# Altium schematic sheet Sheet1.SchDoc
size 1249 x 800 mm; SheetNumber: 1; SheetTotal: 1
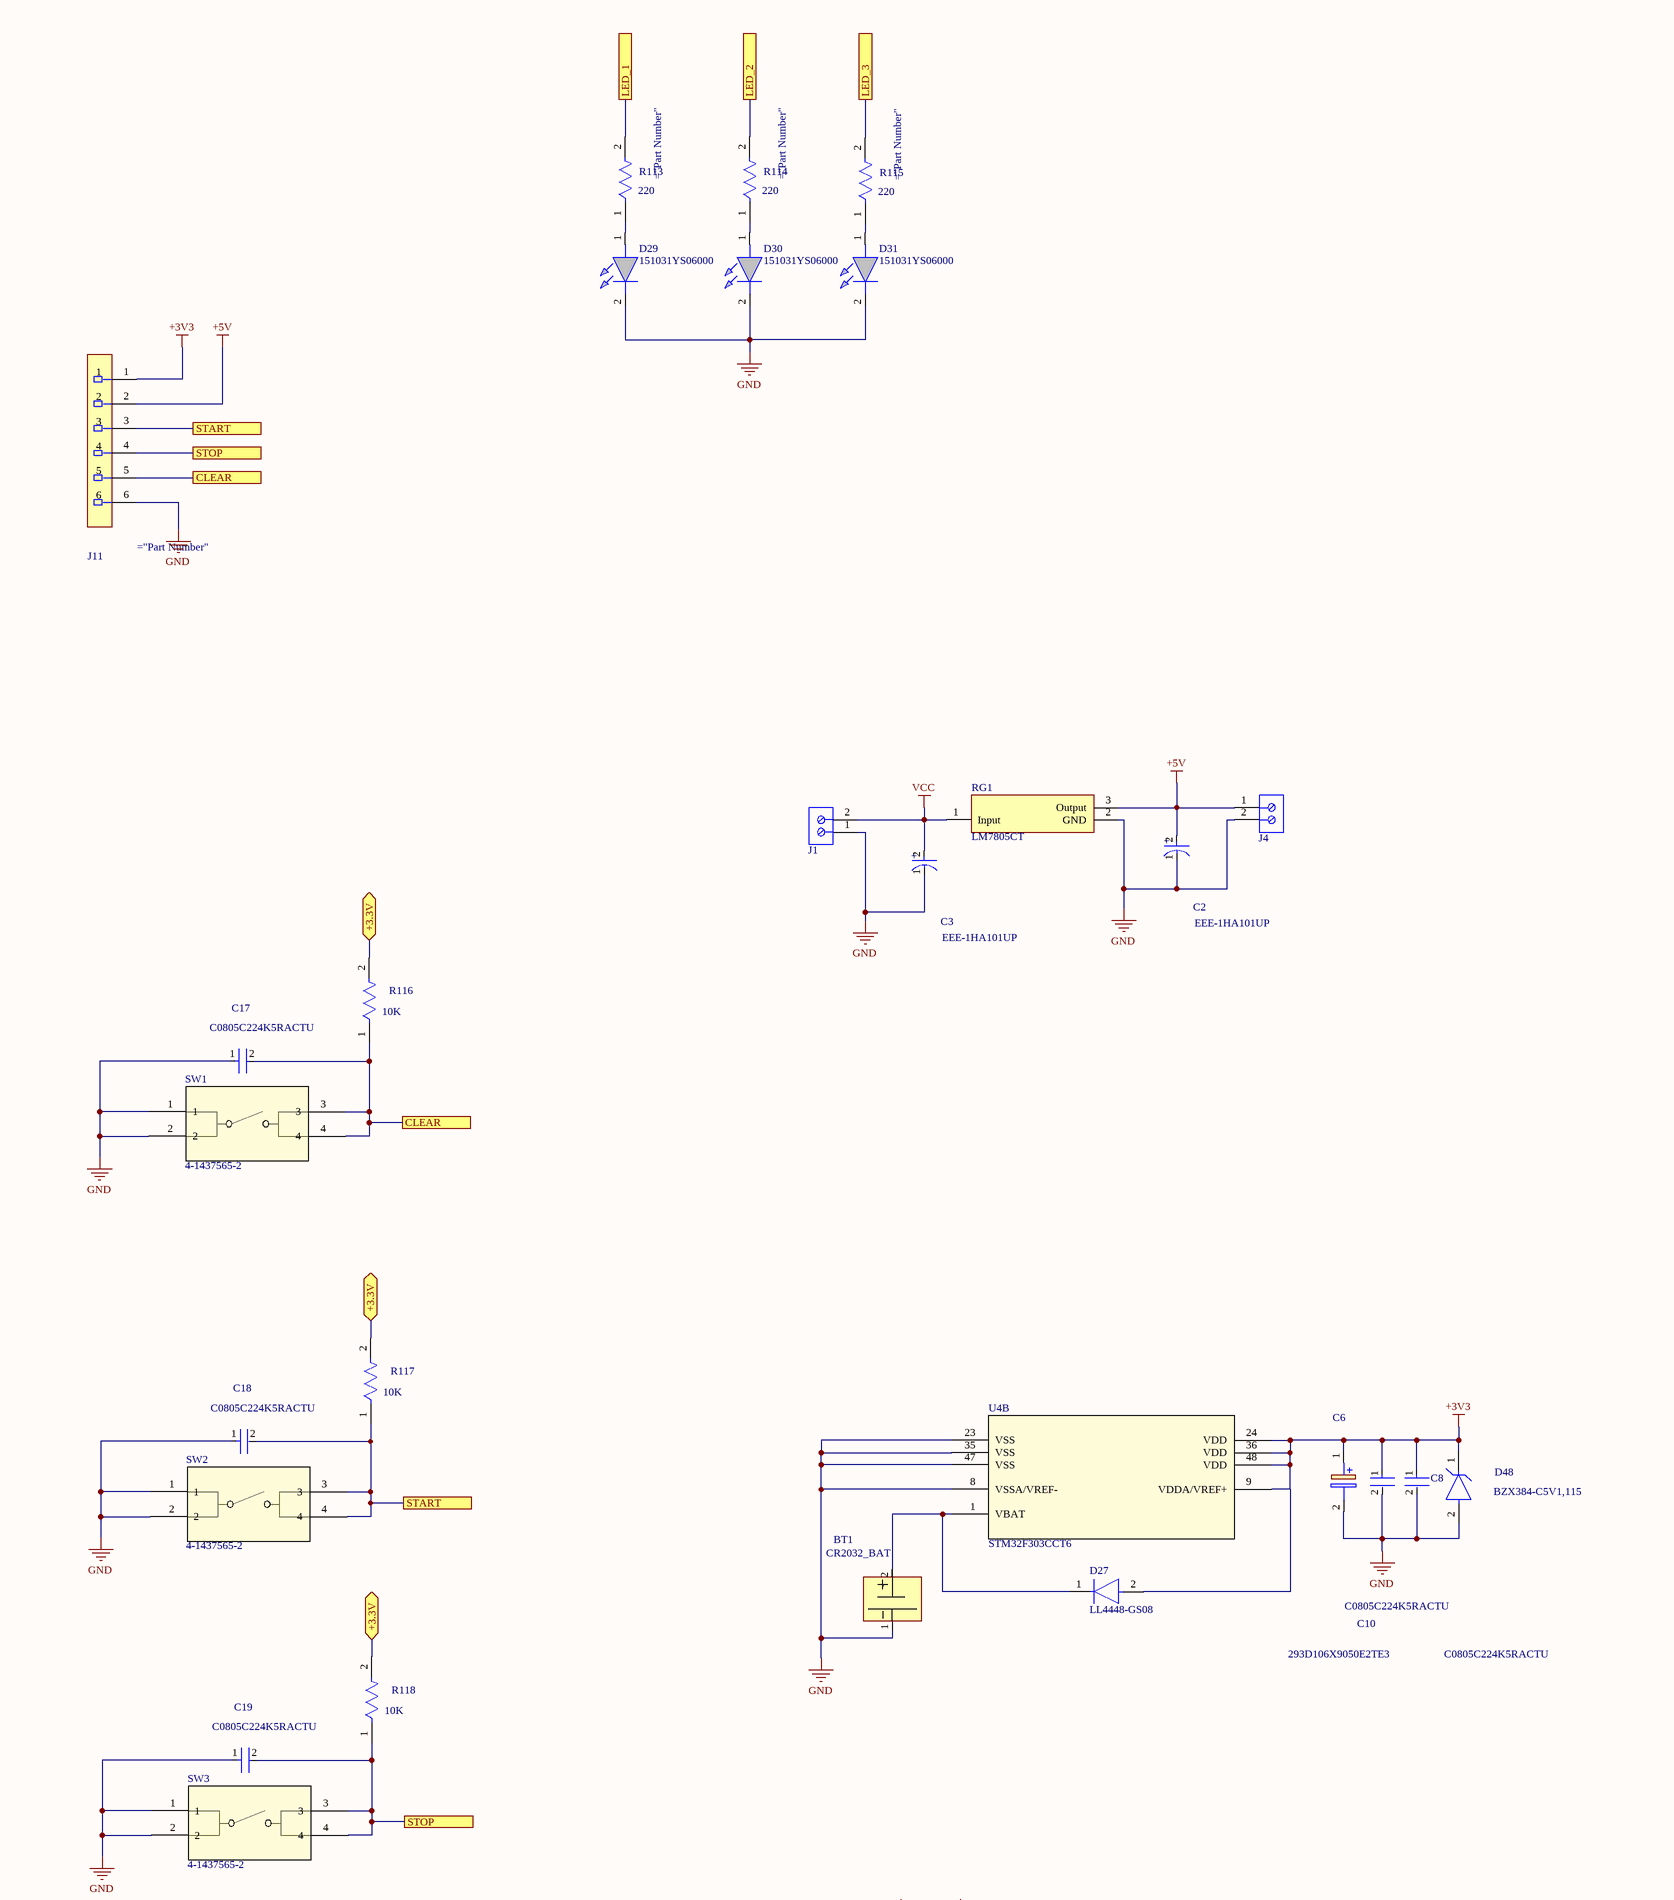
[diagram p0: Sheet1.SchDoc, top left]
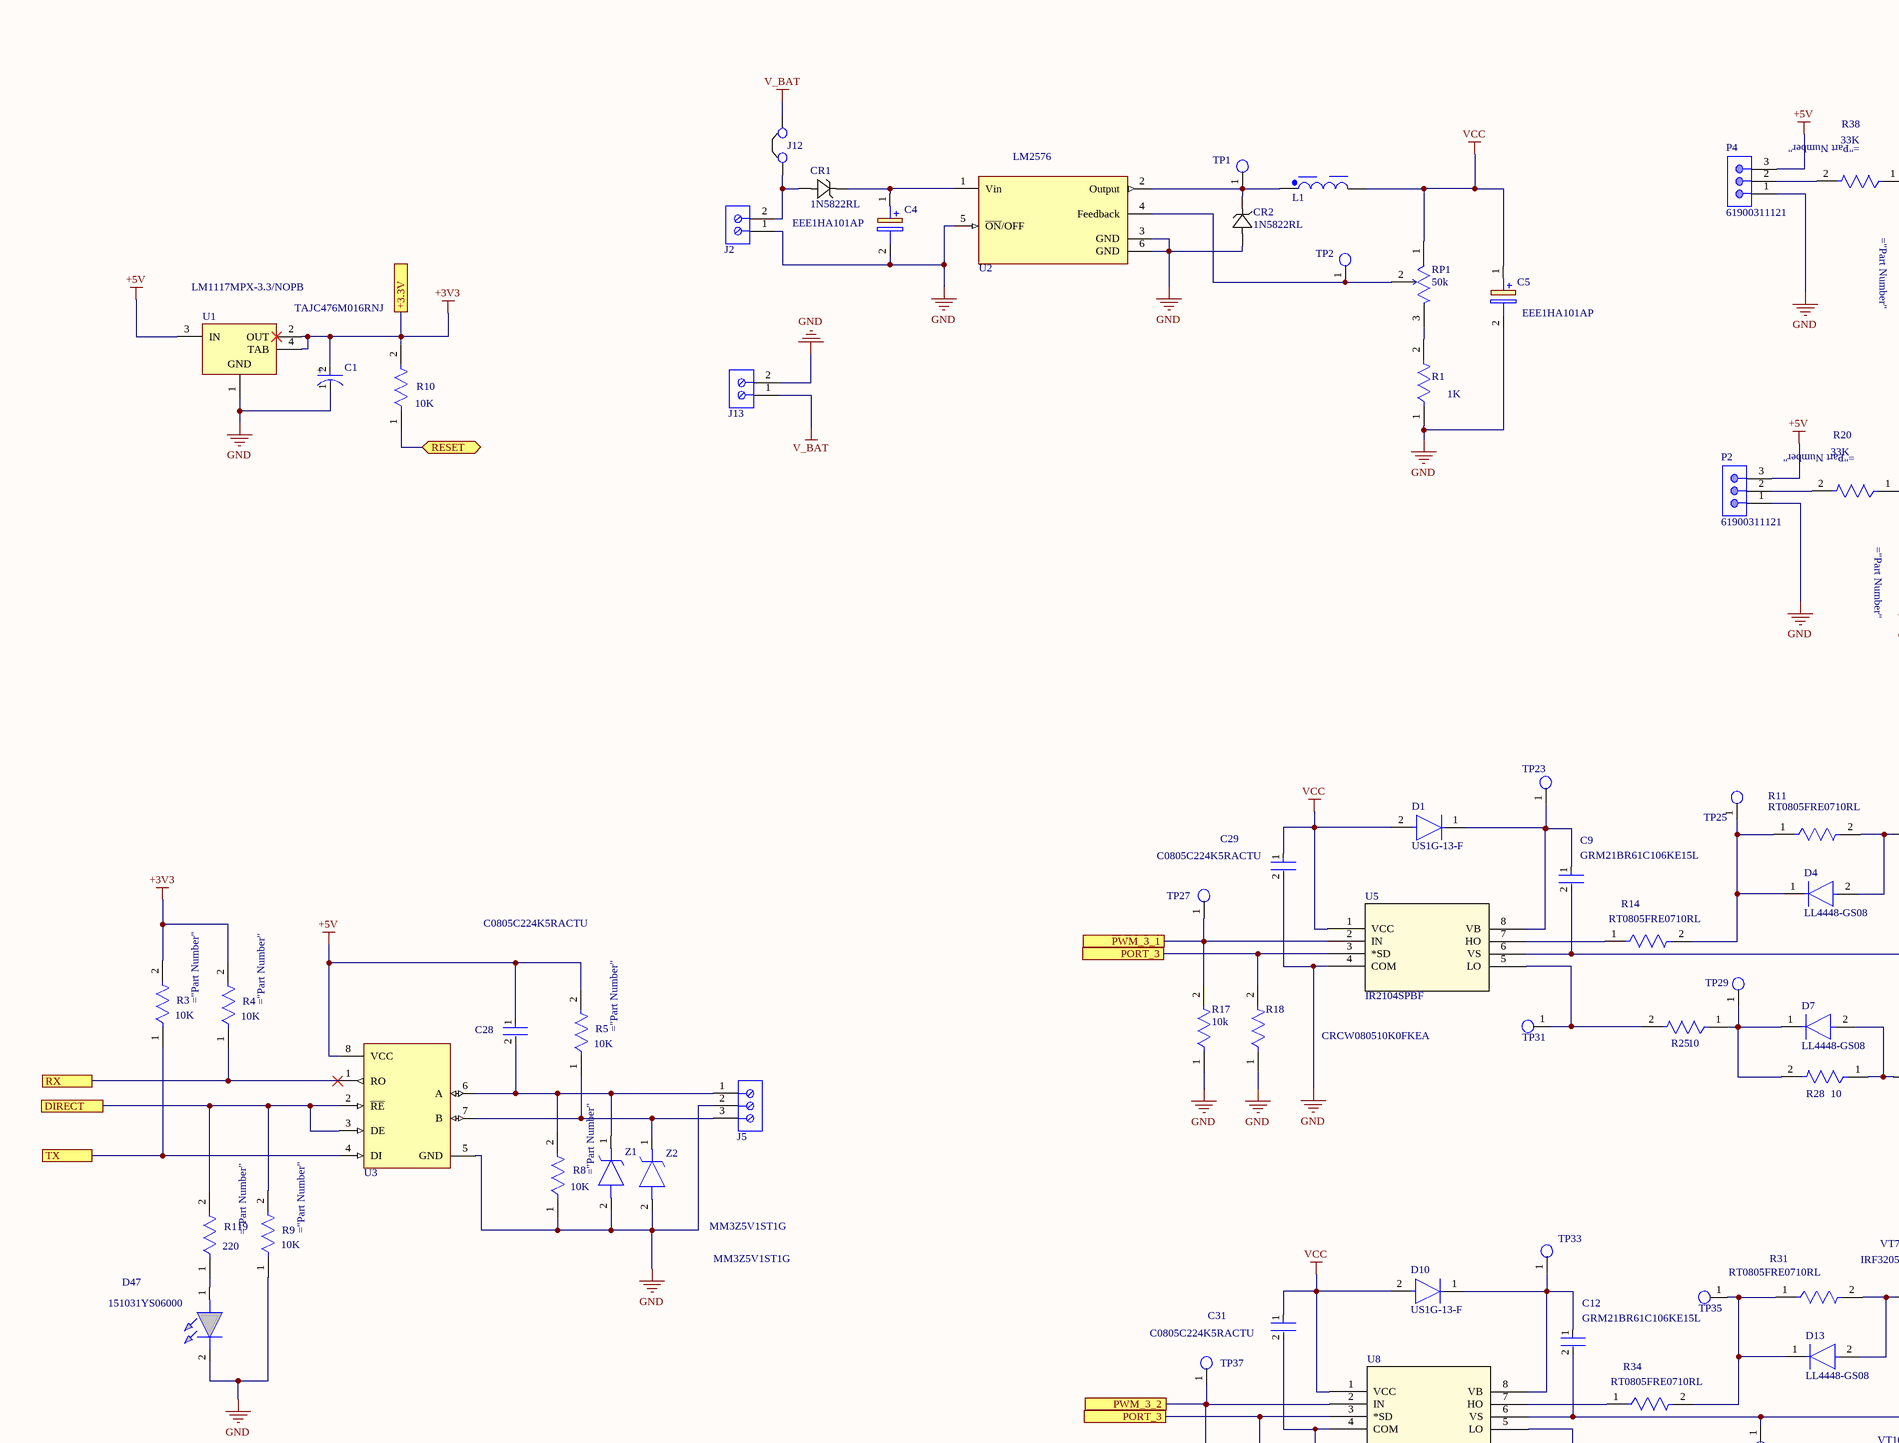
[diagram p1: Sheet1.SchDoc, top middle]
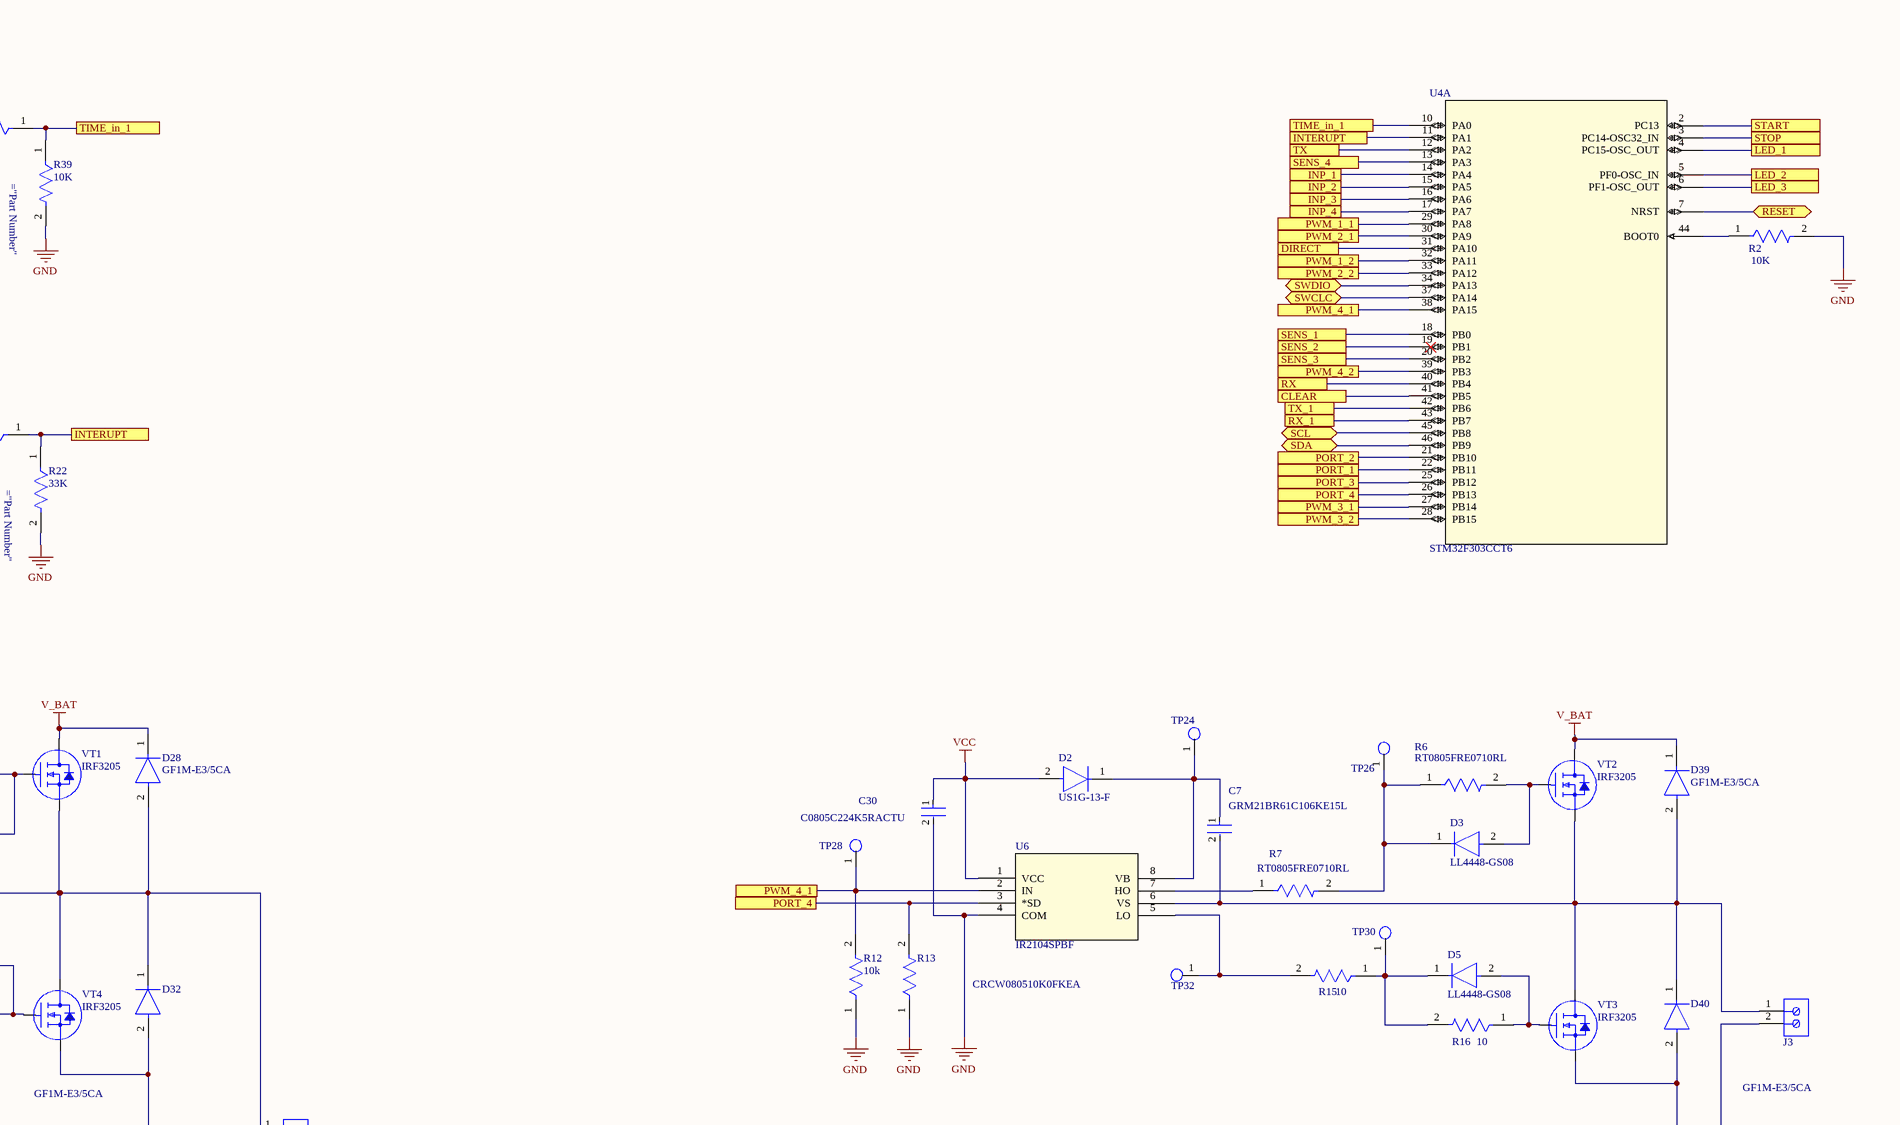
[diagram p2: Sheet1.SchDoc, top right]
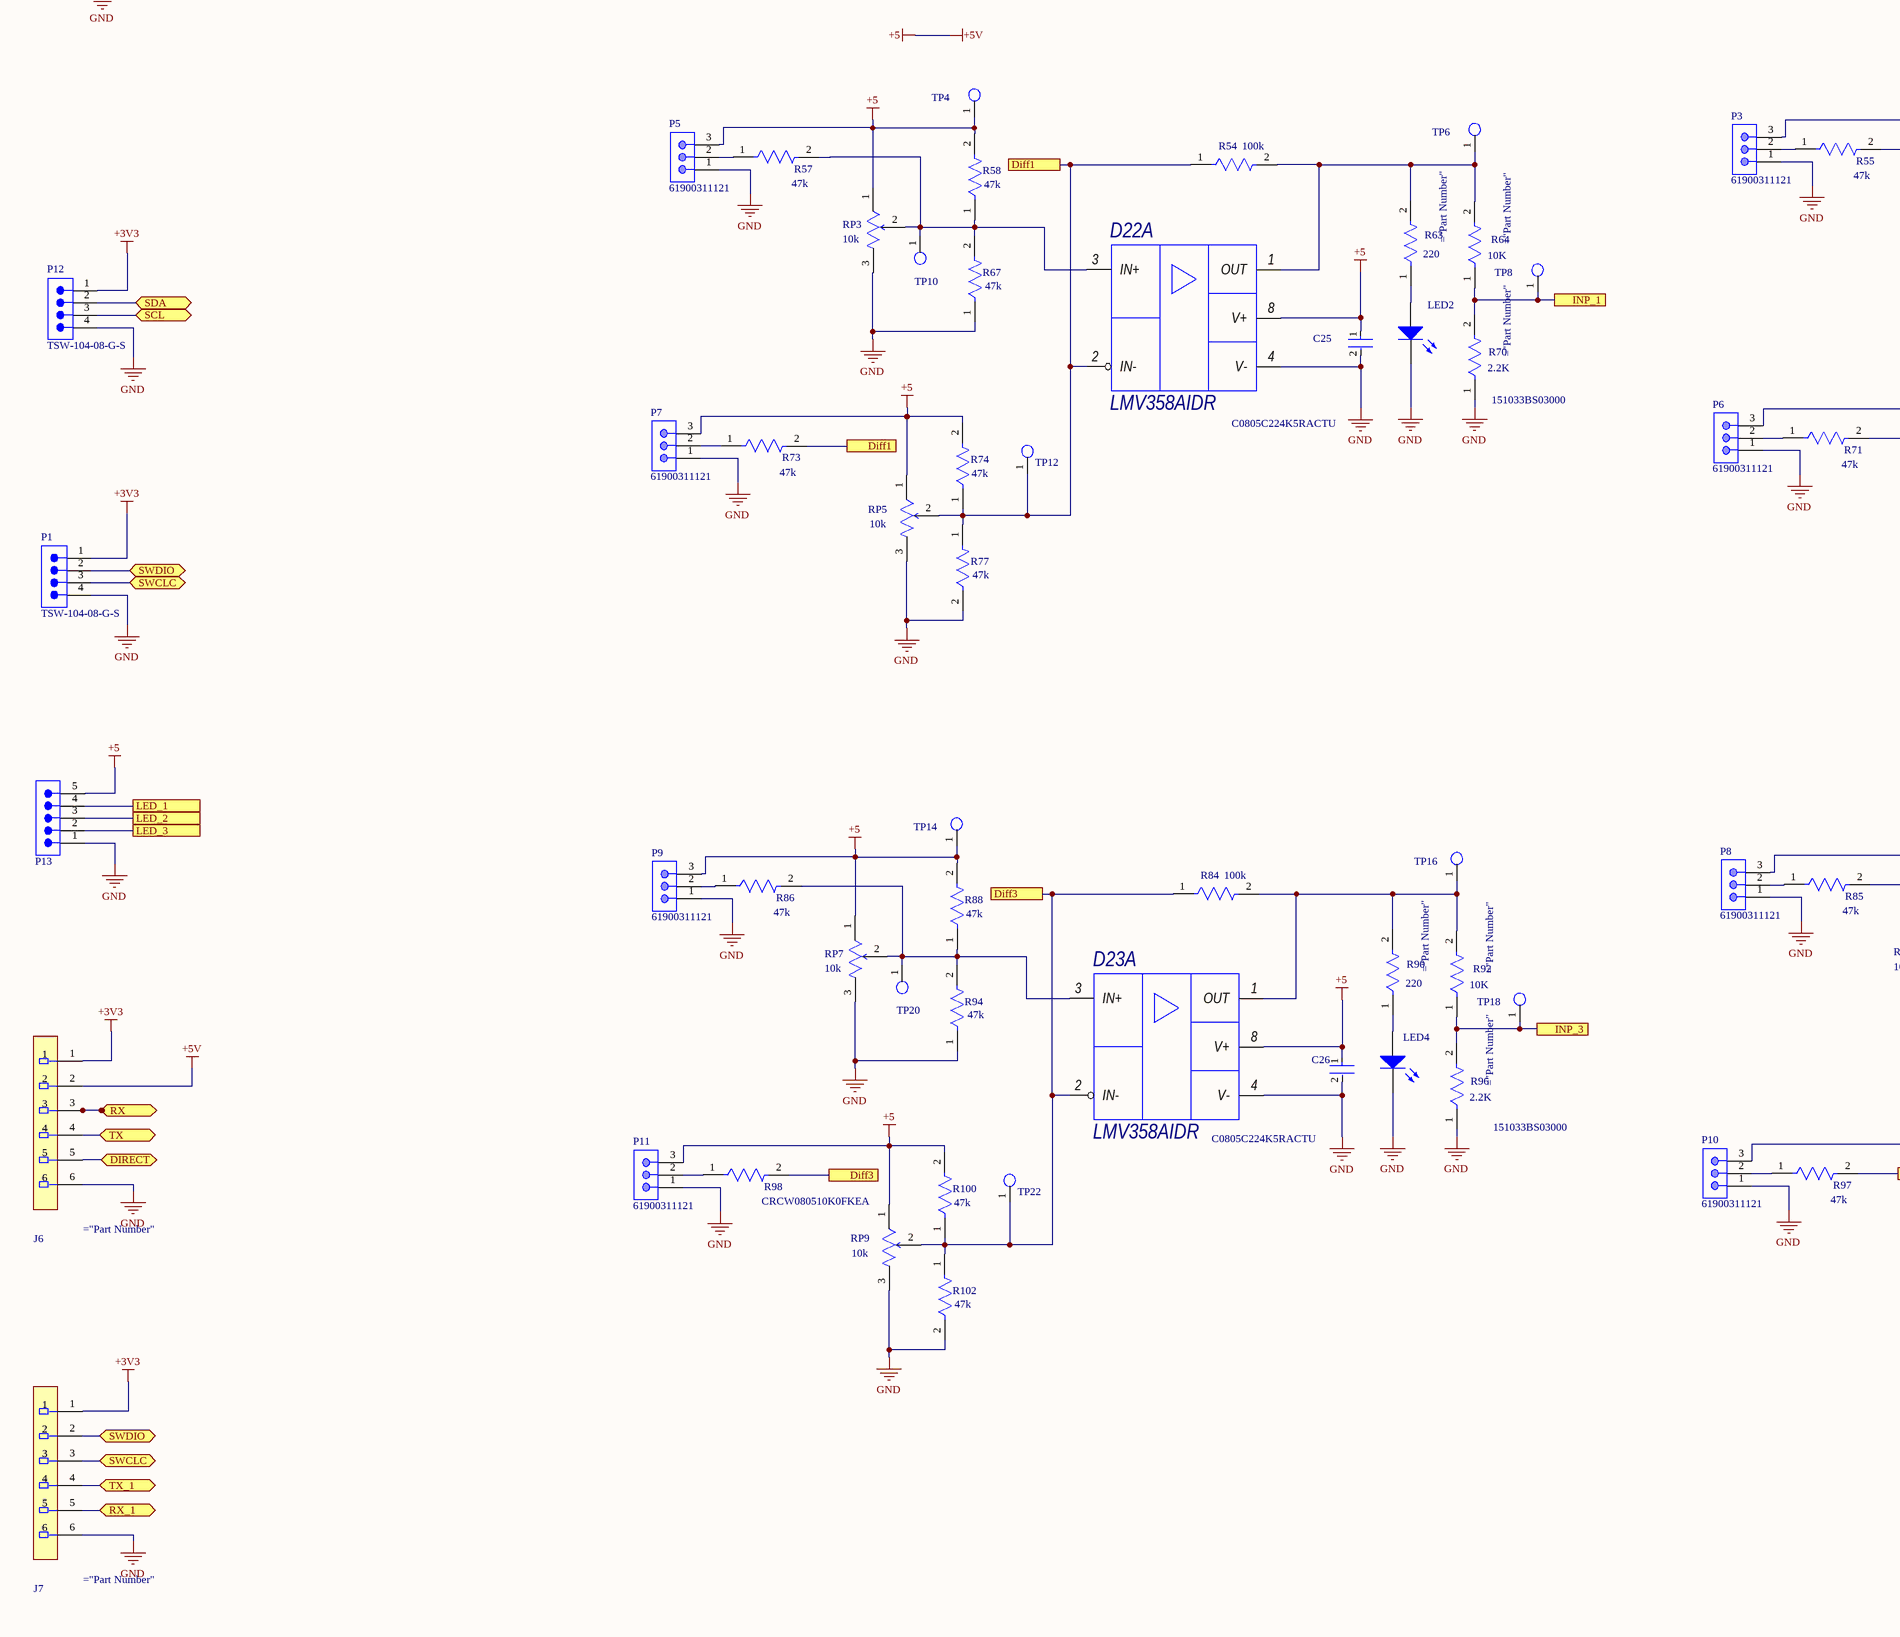
[diagram p3: Sheet1.SchDoc, bottom left]
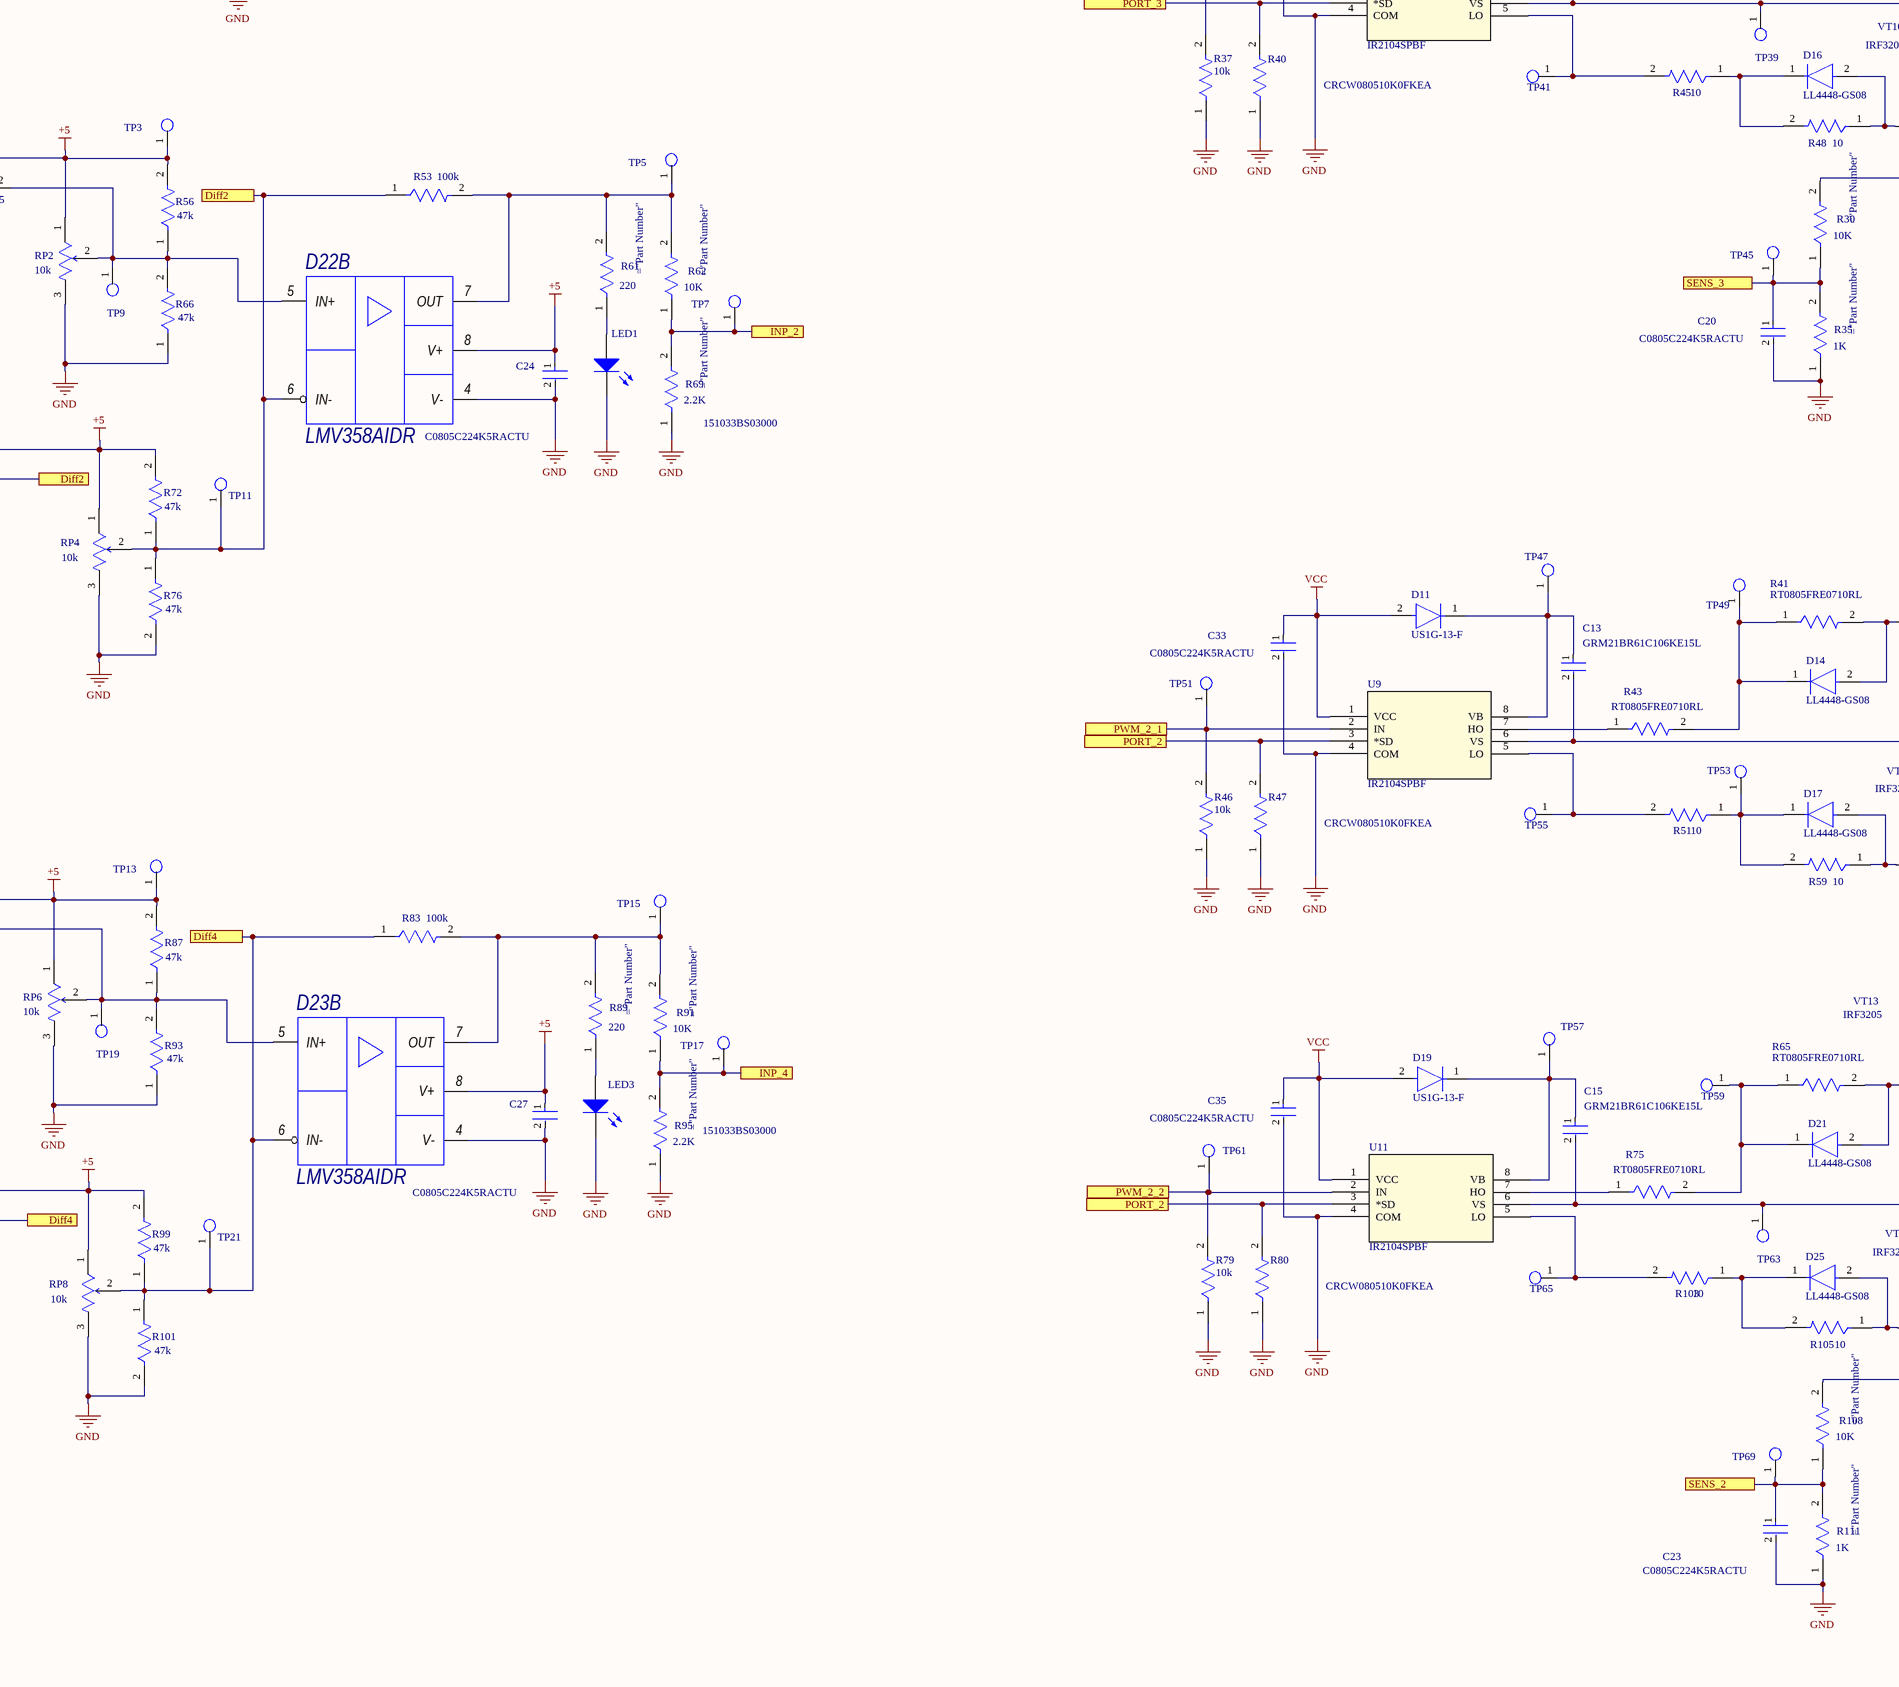
[diagram p4: Sheet1.SchDoc, bottom middle]
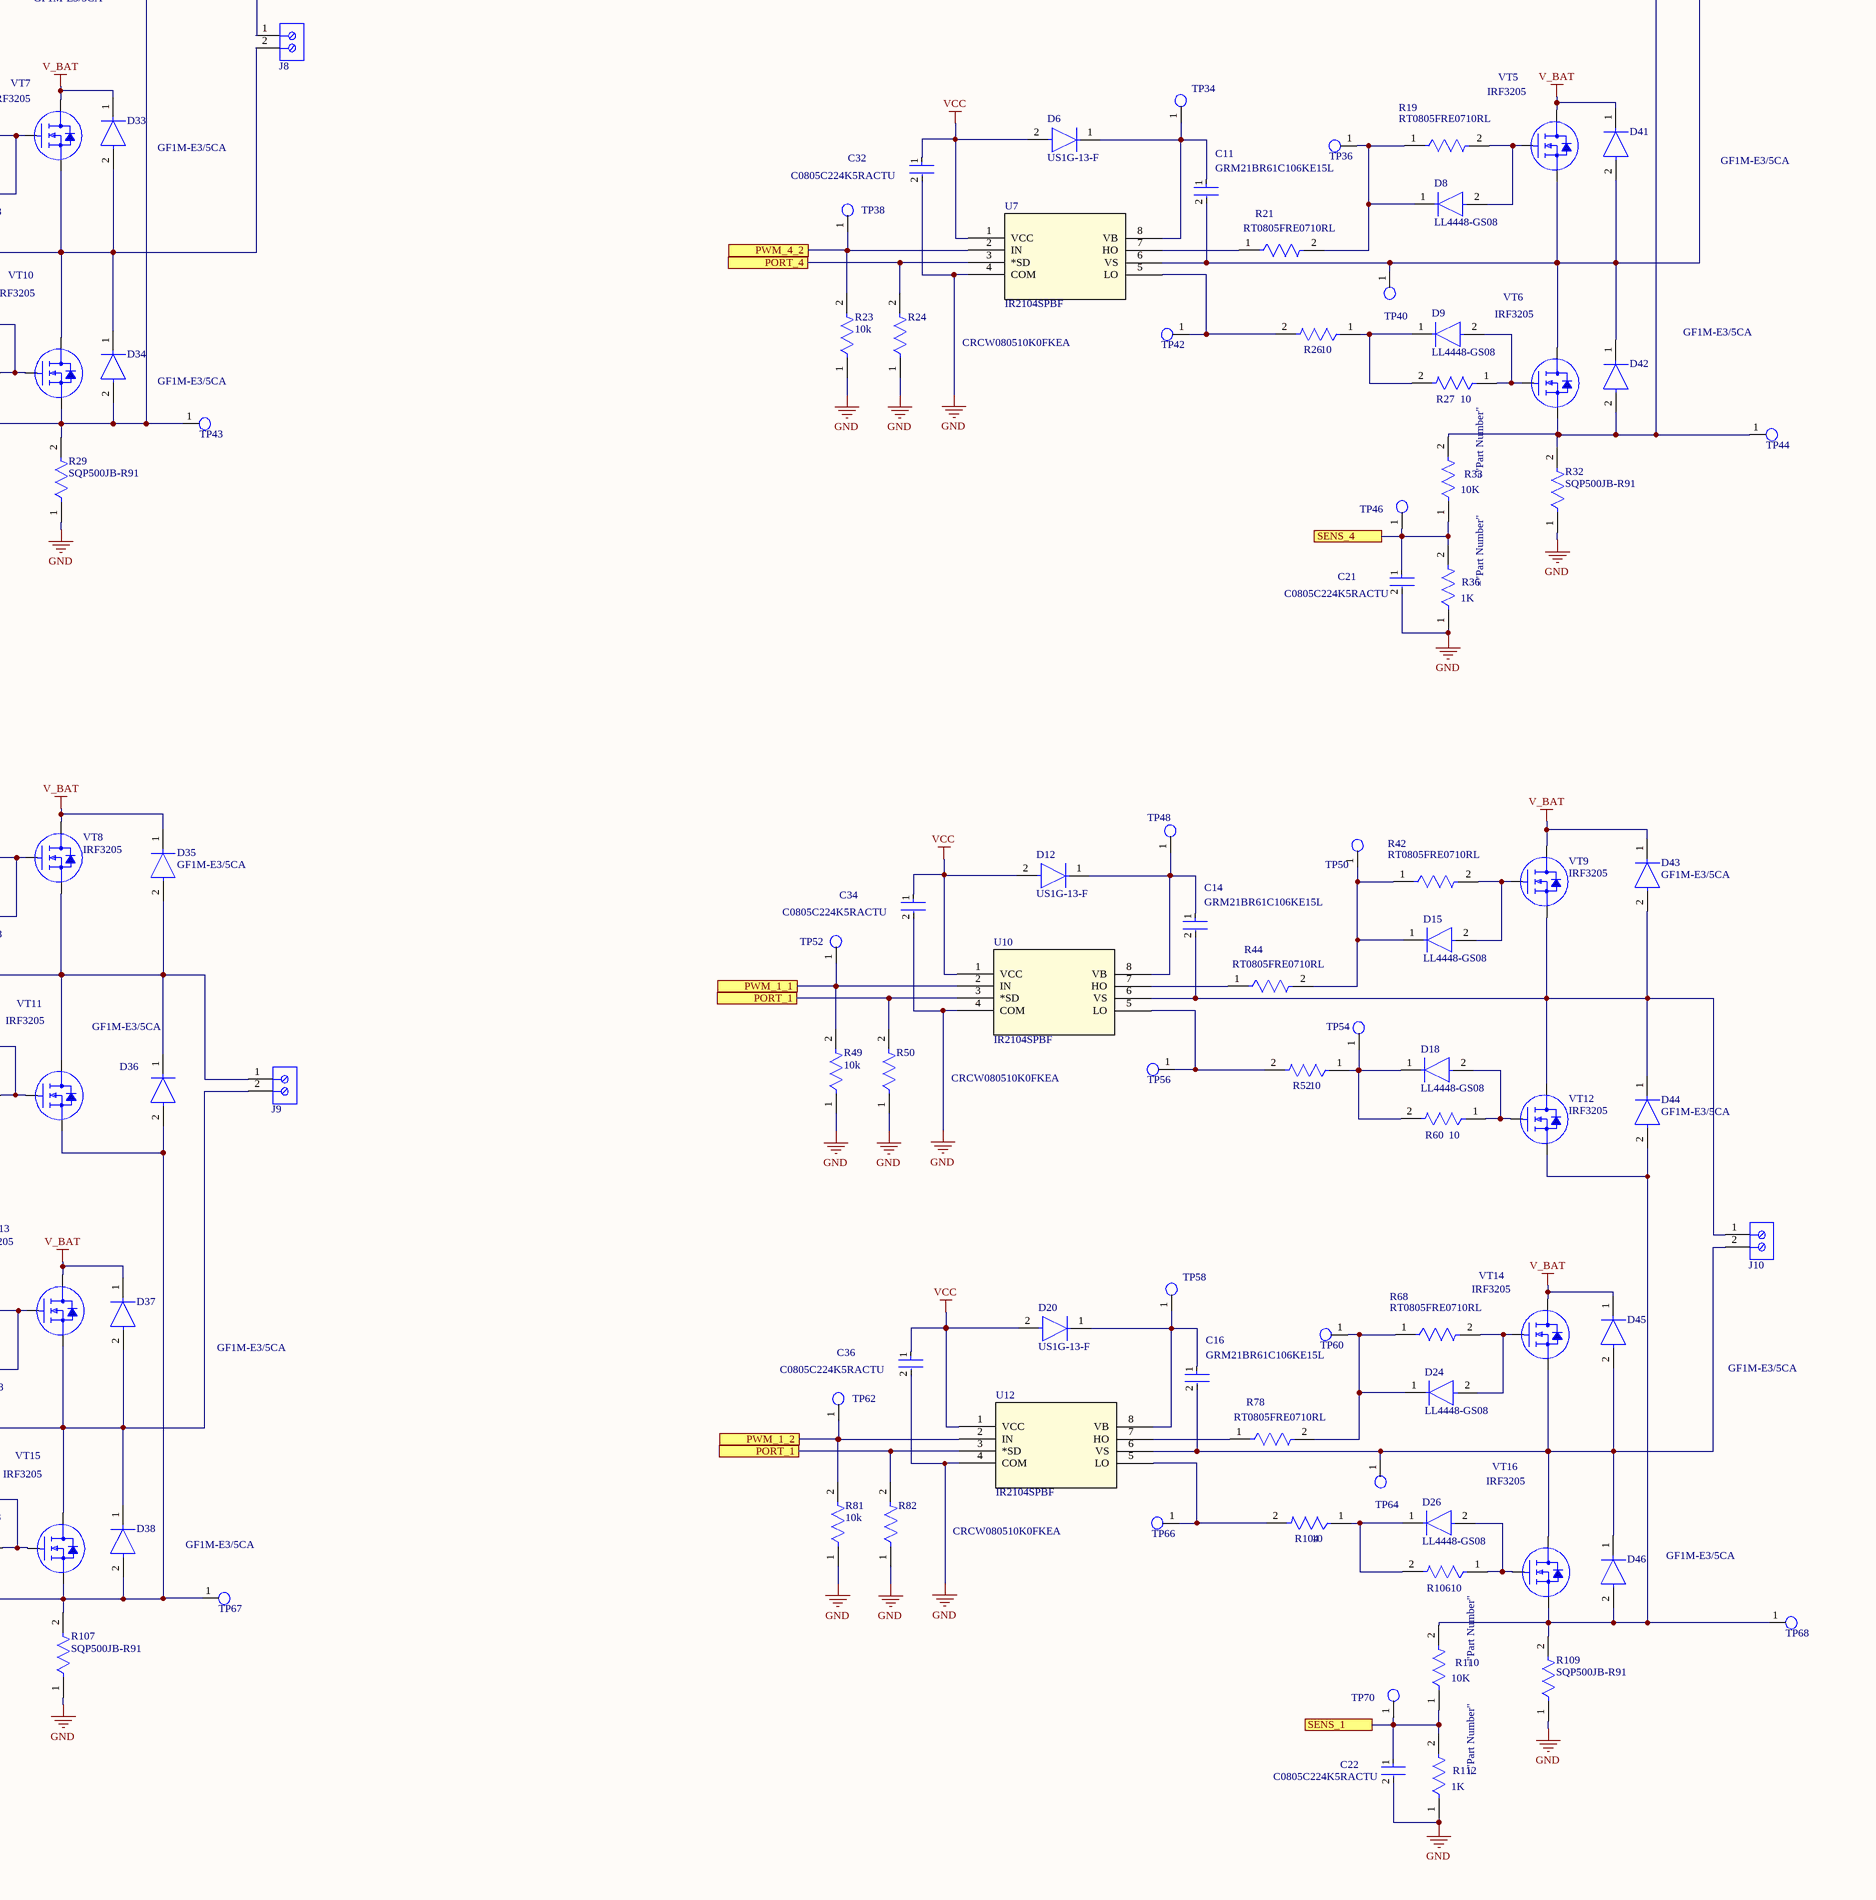
[diagram p5: Sheet1.SchDoc, bottom right]

## Parts
BT1  CR2032_BAT  [CR2032_BAT]
C1  TAJC476M016RNJ  [FP-TAJC-MFG]
C2  EEE-1HA101UP  [FP-SF-MFG]
C3  EEE-1HA101UP  [FP-SF-MFG]
C4  EEE1HA101AP  [EEEFK1V331P]
C5  EEE1HA101AP  [EEEFK1V331P]
C6  293D106X9050E2TE3  [CAPPM7343X430N]
C7  GRM21BR61C106KE15L  [FP-GRM21B-0_1-IPC_C]
C8  C0805C224K5RACTU  [FP-C0805C-DN-MFG]
C9  GRM21BR61C106KE15L  [FP-GRM21B-0_1-IPC_C]
C10  C0805C224K5RACTU  [FP-C0805C-DN-MFG]
C11  GRM21BR61C106KE15L  [FP-GRM21B-0_1-IPC_C]
C12  GRM21BR61C106KE15L  [FP-GRM21B-0_1-IPC_C]
C13  GRM21BR61C106KE15L  [FP-GRM21B-0_1-IPC_C]
C14  GRM21BR61C106KE15L  [FP-GRM21B-0_1-IPC_C]
C15  GRM21BR61C106KE15L  [FP-GRM21B-0_1-IPC_C]
C16  GRM21BR61C106KE15L  [FP-GRM21B-0_1-IPC_C]
C17  C0805C224K5RACTU  [FP-C0805C-DN-IPC_A]
C18  C0805C224K5RACTU  [FP-C0805C-DN-IPC_A]
C19  C0805C224K5RACTU  [FP-C0805C-DN-IPC_A]
C20  C0805C224K5RACTU  [FP-C0805C-DN-MFG]
C21  C0805C224K5RACTU  [FP-C0805C-DN-MFG]
C22  C0805C224K5RACTU  [FP-C0805C-DN-MFG]
C23  C0805C224K5RACTU  [FP-C0805C-DN-MFG]
C24  C0805C224K5RACTU  [FP-C0805C-DN-MFG]
C25  C0805C224K5RACTU  [FP-C0805C-DN-MFG]
C26  C0805C224K5RACTU  [FP-C0805C-DN-MFG]
C27  C0805C224K5RACTU  [FP-C0805C-DN-MFG]
C28  C0805C224K5RACTU  [FP-C0805C-DN-MFG]
C29  C0805C224K5RACTU  [FP-C0805C-DN-MFG]
C30  C0805C224K5RACTU  [FP-C0805C-DN-MFG]
C31  C0805C224K5RACTU  [FP-C0805C-DN-MFG]
C32  C0805C224K5RACTU  [FP-C0805C-DN-MFG]
C33  C0805C224K5RACTU  [FP-C0805C-DN-MFG]
C34  C0805C224K5RACTU  [FP-C0805C-DN-MFG]
C35  C0805C224K5RACTU  [FP-C0805C-DN-MFG]
C36  C0805C224K5RACTU  [FP-C0805C-DN-MFG]
CR1  1N5822RL  [DO-201AD_STM]
CR2  1N5822RL  [DO-201AD_STM]
D1  US1G-13-F  [FP-SMA-MFG]
D2  US1G-13-F  [FP-SMA-MFG]
D3  LL4448-GS08  [FP-6_560-5005_01-4-MFG]
D4  LL4448-GS08  [FP-6_560-5005_01-4-MFG]
D5  LL4448-GS08  [FP-6_560-5005_01-4-MFG]
D6  US1G-13-F  [FP-SMA-MFG]
D7  LL4448-GS08  [FP-6_560-5005_01-4-MFG]
D8  LL4448-GS08  [FP-6_560-5005_01-4-MFG]
D9  LL4448-GS08  [FP-6_560-5005_01-4-MFG]
D10  US1G-13-F  [FP-SMA-MFG]
D11  US1G-13-F  [FP-SMA-MFG]
D12  US1G-13-F  [FP-SMA-MFG]
D13  LL4448-GS08  [FP-6_560-5005_01-4-MFG]
D14  LL4448-GS08  [FP-6_560-5005_01-4-MFG]
D15  LL4448-GS08  [FP-6_560-5005_01-4-MFG]
D16  LL4448-GS08  [FP-6_560-5005_01-4-MFG]
D17  LL4448-GS08  [FP-6_560-5005_01-4-MFG]
D18  LL4448-GS08  [FP-6_560-5005_01-4-MFG]
D19  US1G-13-F  [FP-SMA-MFG]
D20  US1G-13-F  [FP-SMA-MFG]
D21  LL4448-GS08  [FP-6_560-5005_01-4-MFG]
D22  LMV358AIDR  [8-SOIC]  (parts A,B of 2)
D23  LMV358AIDR  [8-SOIC]  (parts A,B of 2)
D24  LL4448-GS08  [FP-6_560-5005_01-4-MFG]
D25  LL4448-GS08  [FP-6_560-5005_01-4-MFG]
D26  LL4448-GS08  [FP-6_560-5005_01-4-MFG]
D27  LL4448-GS08  [FP-6_560-5005_01-4-MFG]
D28  GF1M-E3/5CA  [FP-GF1M-E3-5CA-MFG]
D29  151031YS06000  [Wurth_Electronics_0_MFG]
D30  151031YS06000  [LED_GREEN]
D31  151031YS06000  [LED_BLUE]
D32  GF1M-E3/5CA  [FP-GF1M-E3-5CA-MFG]
D33  GF1M-E3/5CA  [FP-GF1M-E3-5CA-MFG]
D34  GF1M-E3/5CA  [FP-GF1M-E3-5CA-MFG]
D35  GF1M-E3/5CA  [FP-GF1M-E3-5CA-MFG]
D36  GF1M-E3/5CA  [FP-GF1M-E3-5CA-MFG]
D37  GF1M-E3/5CA  [FP-GF1M-E3-5CA-MFG]
D38  GF1M-E3/5CA  [FP-GF1M-E3-5CA-MFG]
D39  GF1M-E3/5CA  [FP-GF1M-E3-5CA-MFG]
D40  GF1M-E3/5CA  [FP-GF1M-E3-5CA-MFG]
D41  GF1M-E3/5CA  [FP-GF1M-E3-5CA-MFG]
D42  GF1M-E3/5CA  [FP-GF1M-E3-5CA-MFG]
D43  GF1M-E3/5CA  [FP-GF1M-E3-5CA-MFG]
D44  GF1M-E3/5CA  [FP-GF1M-E3-5CA-MFG]
D45  GF1M-E3/5CA  [FP-GF1M-E3-5CA-MFG]
D46  GF1M-E3/5CA  [FP-GF1M-E3-5CA-MFG]
D47  151031YS06000  [LED_BLUE]
D48  BZX384-C5V1,115  [FP-SOD323-MFG]
J1  691101710002  [691101710002]  (value not drawn)
J2  691101710002  [691101710002]  (value not drawn)
J3  691101710002  [691101710002]  (value not drawn)
J4  691101710002  [691101710002]  (value not drawn)
J5  691101710003  [691101710003]  (value not drawn)
J6  SWR25X-NRTC-S06-ST-BA  [Sullins_SWR25X-NRTC-S06-ST-BA_MFG]  (value not drawn)
J7  SWR25X-NRTC-S06-ST-BA  [Sullins_SWR25X-NRTC-S06-ST-BA_MFG]  (value not drawn)
J8  691101710002  [691101710002]  (value not drawn)
J9  691101710002  [691101710002]  (value not drawn)
J10  691101710002  [691101710002]  (value not drawn)
J11  SWR25X-NRTC-S06-ST-BA  [Sullins_SWR25X-NRTC-S06-ST-BA_MFG]  (value not drawn)
J12  Jumper 1x2.54  [Jumper_2.54]  (value not drawn)
J13  691101710002  [691101710002]  (value not drawn)
L1  22µH, 2.04A  [WE-PD2_1054]  (value not drawn)
LED1  151033BS03000  [Type 3mm]
LED2  151033BS03000  [Type 3mm]
LED3  151033BS03000  [Type 3mm]
LED4  151033BS03000  [Type 3mm]
P1  TSW-104-08-G-S  [SMTC-TSW-104-08-X-S]
P2  61900311121  [61900311121]
P3  61900311121  [61900311121]
P4  61900311121  [61900311121]
P5  61900311121  [61900311121]
P6  61900311121  [61900311121]
P7  61900311121  [61900311121]
P8  61900311121  [61900311121]
P9  61900311121  [61900311121]
P10  61900311121  [61900311121]
P11  61900311121  [61900311121]
P12  TSW-104-08-G-S  [SMTC-TSW-104-08-X-S]
P13  61300511121  [61300511121]  (value not drawn)
R1  1K  [Vishay_CRCW0805-e3_IPC_C]
R2  10K  [Vishay_CRCW0805-e3_IPC_A]
R3  10K  [Vishay_CRCW0805-e3_IPC_A]
R4  10K  [Vishay_CRCW0805-e3_IPC_A]
R5  10K  [Vishay_CRCW0805-e3_IPC_A]
R6  RT0805FRE0710RL  [FP-RT0805-IPC_C]
R7  RT0805FRE0710RL  [FP-RT0805-MFG]
R8  10K  [Vishay_CRCW0805-e3_IPC_A]
R9  10K  [Vishay_CRCW0805-e3_IPC_A]
R10  10K  [Vishay_CRCW0805-e3_IPC_A]
R11  RT0805FRE0710RL  [FP-RT0805-IPC_C]
R12  10k  [Vishay_CRCW0805-e3_IPC_A]
R13  CRCW080510K0FKEA  [FP-CRCW0805-e3-IPC_A]
R14  RT0805FRE0710RL  [FP-RT0805-MFG]
R15  10  [Vishay_CRCW0805-e3_IPC_A]
R16  10  [Vishay_CRCW0805-e3_IPC_A]
R17  10k  [Vishay_CRCW0805-e3_IPC_A]
R18  CRCW080510K0FKEA  [FP-CRCW0805-e3-IPC_A]
R19  RT0805FRE0710RL  [FP-RT0805-IPC_C]
R20  33K  [Vishay_CRCW0805-e3_IPC_A]
R21  RT0805FRE0710RL  [FP-RT0805-MFG]
R22  33K  [Vishay_CRCW0805-e3_IPC_A]
R23  10k  [Vishay_CRCW0805-e3_IPC_A]
R24  CRCW080510K0FKEA  [FP-CRCW0805-e3-IPC_A]
R25  10  [Vishay_CRCW0805-e3_IPC_A]
R26  10  [Vishay_CRCW0805-e3_IPC_A]
R27  10  [Vishay_CRCW0805-e3_IPC_A]
R28  10  [Vishay_CRCW0805-e3_IPC_A]
R29  SQP500JB-R91  [FP-SQP500-MFG]
R30  10K  [Yageo_RC0805_IPC_C]
R31  RT0805FRE0710RL  [FP-RT0805-IPC_C]
R32  SQP500JB-R91  [FP-SQP500-MFG]
R33  10K  [Yageo_RC0805_IPC_C]
R34  RT0805FRE0710RL  [FP-RT0805-MFG]
R35  1K  [Yageo_RC0805_IPC_A]
R36  1K  [Yageo_RC0805_IPC_A]
R37  10k  [Vishay_CRCW0805-e3_IPC_A]
R38  33K  [Vishay_CRCW0805-e3_IPC_A]
R39  10K  [Vishay_CRCW0805-e3_IPC_A]
R40  CRCW080510K0FKEA  [FP-CRCW0805-e3-IPC_A]
R41  RT0805FRE0710RL  [FP-RT0805-IPC_C]
R42  RT0805FRE0710RL  [FP-RT0805-IPC_C]
R43  RT0805FRE0710RL  [FP-RT0805-MFG]
R44  RT0805FRE0710RL  [FP-RT0805-MFG]
R45  10  [Vishay_CRCW0805-e3_IPC_A]
R46  10k  [Vishay_CRCW0805-e3_IPC_A]
R47  CRCW080510K0FKEA  [FP-CRCW0805-e3-IPC_A]
R48  10  [Vishay_CRCW0805-e3_IPC_A]
R49  10k  [Vishay_CRCW0805-e3_IPC_A]
R50  CRCW080510K0FKEA  [FP-CRCW0805-e3-IPC_A]
R51  10  [Vishay_CRCW0805-e3_IPC_A]
R52  10  [Vishay_CRCW0805-e3_IPC_A]
R53  100k  [Vishay_CRCW0805-e3_IPC_A]
R54  100k  [Vishay_CRCW0805-e3_IPC_A]
R55  47k  [Vishay_CRCW0805-e3_IPC_A]
R56  47k  [Vishay_CRCW0805-e3_IPC_A]
R57  47k  [FP-CRCW0805-e3-IPC_A]
R58  47k  [Vishay_CRCW0805-e3_IPC_A]
R59  10  [Vishay_CRCW0805-e3_IPC_A]
R60  10  [Vishay_CRCW0805-e3_IPC_A]
R61  220  [Vishay_CRCW0805-e3_IPC_A]
R62  10K  [Vishay_CRCW0805-e3_IPC_A]
R63  220  [Vishay_CRCW0805-e3_IPC_A]
R64  10K  [Vishay_CRCW0805-e3_IPC_A]
R65  RT0805FRE0710RL  [FP-RT0805-IPC_C]
R66  47k  [Vishay_CRCW0805-e3_IPC_A]
R67  47k  [Vishay_CRCW0805-e3_IPC_A]
R68  RT0805FRE0710RL  [FP-RT0805-IPC_C]
R69  2.2K  [Yageo_RC0805_IPC_A]
R70  2.2K  [Vishay_CRCW0805-e3_IPC_A]
R71  47k  [Vishay_CRCW0805-e3_IPC_A]
R72  47k  [Vishay_CRCW0805-e3_IPC_A]
R73  47k  [Vishay_CRCW0805-e3_IPC_A]
R74  47k  [Vishay_CRCW0805-e3_IPC_A]
R75  RT0805FRE0710RL  [FP-RT0805-MFG]
R76  47k  [Vishay_CRCW0805-e3_IPC_A]
R77  47k  [Vishay_CRCW0805-e3_IPC_A]
R78  RT0805FRE0710RL  [FP-RT0805-MFG]
R79  10k  [Vishay_CRCW0805-e3_IPC_A]
R80  CRCW080510K0FKEA  [FP-CRCW0805-e3-IPC_A]
R81  10k  [Vishay_CRCW0805-e3_IPC_A]
R82  CRCW080510K0FKEA  [FP-CRCW0805-e3-IPC_A]
R83  100k  [Vishay_CRCW0805-e3_IPC_A]
R84  100k  [Vishay_CRCW0805-e3_IPC_A]
R85  47k  [Vishay_CRCW0805-e3_IPC_A]
R86  47k  [Vishay_CRCW0805-e3_IPC_A]
R87  47k  [Vishay_CRCW0805-e3_IPC_A]
R88  47k  [FP-CRCW0805-e3-IPC_A]
R89  220  [Vishay_CRCW0805-e3_IPC_A]
R90  220  [Vishay_CRCW0805-e3_IPC_A]
R91  10K  [Vishay_CRCW0805-e3_IPC_A]
R92  10K  [Vishay_CRCW0805-e3_IPC_A]
R93  47k  [Vishay_CRCW0805-e3_IPC_A]
R94  47k  [Vishay_CRCW0805-e3_IPC_A]
R95  2.2K  [Vishay_CRCW0805-e3_IPC_A]
R96  2.2K  [Vishay_CRCW0805-e3_IPC_A]
R97  47k  [Vishay_CRCW0805-e3_IPC_A]
R98  CRCW080510K0FKEA  [FP-CRCW0805-e3-IPC_A]
R99  47k  [Vishay_CRCW0805-e3_IPC_A]
R100  47k  [Vishay_CRCW0805-e3_IPC_A]
R101  47k  [Vishay_CRCW0805-e3_IPC_A]
R102  47k  [Vishay_CRCW0805-e3_IPC_A]
R103  10  [Vishay_CRCW0805-e3_IPC_A]
R104  10  [Vishay_CRCW0805-e3_IPC_A]
R105  10  [Vishay_CRCW0805-e3_IPC_A]
R106  10  [Vishay_CRCW0805-e3_IPC_A]
R107  SQP500JB-R91  [FP-SQP500-MFG]
R108  10K  [Yageo_RC0805_IPC_C]
R109  SQP500JB-R91  [FP-SQP500-MFG]
R110  10K  [Yageo_RC0805_IPC_C]
R111  1K  [Yageo_RC0805_IPC_A]
R112  1K  [Yageo_RC0805_IPC_A]
R113  220  [Yageo_RC0805_IPC_C]
R114  220  [Yageo_RC0805_IPC_A]
R115  220  [Yageo_RC0805_IPC_A]
R116  10K  [FP-CRCW0805-e3-IPC_A]
R117  10K  [FP-CRCW0805-e3-IPC_A]
R118  10K  [FP-CRCW0805-e3-IPC_A]
R119  220  [Yageo_RC0805_IPC_A]
RG1  Part Number: LM7805CT  [TO-220(bend_rad)]  (hidden comment: Reg_Fairchild_LM7805CT_eec)
RP1  50k  [Bourns_3296W_MFG]
RP2  10k  [Bourns_3296W_MFG]
RP3  10k  [Bourns_3296W_MFG]
RP4  10k  [Bourns_3296W_MFG]
RP5  10k  [Bourns_3296W_MFG]
RP6  10k  [Bourns_3296W_MFG]
RP7  10k  [Bourns_3296W_MFG]
RP8  10k  [Bourns_3296W_MFG]
RP9  10k  [Bourns_3296W_MFG]
SW1  4-1437565-2  [SW4_FSM-5P23_TEC]
SW2  4-1437565-2  [SW4_FSM-5P23_TEC]
SW3  4-1437565-2  [SW4_FSM-5P23_TEC]
TP1  Test_Point_PCB  [Test_Point]  (value not drawn)
TP2  Test_Point_PCB  [Test_Point]  (value not drawn)
TP3  Test_Point_PCB  [Test_Point]  (value not drawn)
TP4  Test_Point_PCB  [Test_Point]  (value not drawn)
TP5  Test_Point_PCB  [Test_Point]  (value not drawn)
TP6  Test_Point_PCB  [Test_Point]  (value not drawn)
TP7  Test_Point_PCB  [Test_Point]  (value not drawn)
TP8  Test_Point_PCB  [Test_Point]  (value not drawn)
TP9  Test_Point_PCB  [Test_Point]  (value not drawn)
TP10  Test_Point_PCB  [Test_Point]  (value not drawn)
TP11  Test_Point_PCB  [Test_Point]  (value not drawn)
TP12  Test_Point_PCB  [Test_Point]  (value not drawn)
TP13  Test_Point_PCB  [Test_Point]  (value not drawn)
TP14  Test_Point_PCB  [Test_Point]  (value not drawn)
TP15  Test_Point_PCB  [Test_Point]  (value not drawn)
TP16  Test_Point_PCB  [Test_Point]  (value not drawn)
TP17  Test_Point_PCB  [Test_Point]  (value not drawn)
TP18  Test_Point_PCB  [Test_Point]  (value not drawn)
TP19  Test_Point_PCB  [Test_Point]  (value not drawn)
TP20  Test_Point_PCB  [Test_Point]  (value not drawn)
TP21  Test_Point_PCB  [Test_Point]  (value not drawn)
TP22  Test_Point_PCB  [Test_Point]  (value not drawn)
TP23  Test_Point_PCB  [Test_Point]  (value not drawn)
TP24  Test_Point_PCB  [Test_Point]  (value not drawn)
TP25  Test_Point_PCB  [Test_Point]  (value not drawn)
TP26  Test_Point_PCB  [Test_Point]  (value not drawn)
TP27  Test_Point_PCB  [Test_Point]  (value not drawn)
TP28  Test_Point_PCB  [Test_Point]  (value not drawn)
TP29  Test_Point_PCB  [Test_Point]  (value not drawn)
TP30  Test_Point_PCB  [Test_Point]  (value not drawn)
TP31  Test_Point_PCB  [Test_Point]  (value not drawn)
TP32  Test_Point_PCB  [Test_Point]  (value not drawn)
TP33  Test_Point_PCB  [Test_Point]  (value not drawn)
TP34  Test_Point_PCB  [Test_Point]  (value not drawn)
TP35  Test_Point_PCB  [Test_Point]  (value not drawn)
TP36  Test_Point_PCB  [Test_Point]  (value not drawn)
TP37  Test_Point_PCB  [Test_Point]  (value not drawn)
TP38  Test_Point_PCB  [Test_Point]  (value not drawn)
TP39  Test_Point_PCB  [Test_Point]  (value not drawn)
TP40  Test_Point_PCB  [Test_Point]  (value not drawn)
TP41  Test_Point_PCB  [Test_Point]  (value not drawn)
TP42  Test_Point_PCB  [Test_Point]  (value not drawn)
TP43  Test_Point_PCB  [Test_Point]  (value not drawn)
TP44  Test_Point_PCB  [Test_Point]  (value not drawn)
TP45  Test_Point_PCB  [Test_Point]  (value not drawn)
TP46  Test_Point_PCB  [Test_Point]  (value not drawn)
TP47  Test_Point_PCB  [Test_Point]  (value not drawn)
TP48  Test_Point_PCB  [Test_Point]  (value not drawn)
TP49  Test_Point_PCB  [Test_Point]  (value not drawn)
TP50  Test_Point_PCB  [Test_Point]  (value not drawn)
TP51  Test_Point_PCB  [Test_Point]  (value not drawn)
TP52  Test_Point_PCB  [Test_Point]  (value not drawn)
TP53  Test_Point_PCB  [Test_Point]  (value not drawn)
TP54  Test_Point_PCB  [Test_Point]  (value not drawn)
TP55  Test_Point_PCB  [Test_Point]  (value not drawn)
TP56  Test_Point_PCB  [Test_Point]  (value not drawn)
TP57  Test_Point_PCB  [Test_Point]  (value not drawn)
TP58  Test_Point_PCB  [Test_Point]  (value not drawn)
TP59  Test_Point_PCB  [Test_Point]  (value not drawn)
TP60  Test_Point_PCB  [Test_Point]  (value not drawn)
TP61  Test_Point_PCB  [Test_Point]  (value not drawn)
TP62  Test_Point_PCB  [Test_Point]  (value not drawn)
TP63  Test_Point_PCB  [Test_Point]  (value not drawn)
TP64  Test_Point_PCB  [Test_Point]  (value not drawn)
TP65  Test_Point_PCB  [Test_Point]  (value not drawn)
TP66  Test_Point_PCB  [Test_Point]  (value not drawn)
TP67  Test_Point_PCB  [Test_Point]  (value not drawn)
TP68  Test_Point_PCB  [Test_Point]  (value not drawn)
TP69  Test_Point_PCB  [Test_Point]  (value not drawn)
TP70  Test_Point_PCB  [Test_Point]  (value not drawn)
U1  LM1117MPX-3.3/NOPB  [DCY0004A_L]
U2  LM2576  [ON_Semiconductor_936A-02_MFG]
U3  MAX485ECSA+  [SOIC127P600X175-8N]  (value not drawn)
U4  STM32F303CCT6  [LQFP48-7x7mm]  (parts A,B of 2)
U5  IR2104SPBF  [SOIC8_INF-M]
U6  IR2104SPBF  [SOIC8_INF-M]
U7  IR2104SPBF  [SOIC8_INF-M]
U8  IR2104SPBF  [SOIC8_INF-M]
U9  IR2104SPBF  [SOIC8_INF-M]
U10  IR2104SPBF  [SOIC8_INF-M]
U11  IR2104SPBF  [SOIC8_INF-M]
U12  IR2104SPBF  [SOIC8_INF-M]
VT1  IRF3205  [TO-220(bend2)]
VT2  IRF3205  [TO-220(bend2)]
VT3  IRF3205  [TO-220(bend2)]
VT4  IRF3205  [TO-220(bend2)]
VT5  IRF3205  [TO-220(bend2)]
VT6  IRF3205  [TO-220(bend2)]
VT7  IRF3205  [TO-220(bend2)]
VT8  IRF3205  [TO-220(bend2)]
VT9  IRF3205  [TO-220(bend2)]
VT10  IRF3205  [TO-220(bend2)]
VT11  IRF3205  [TO-220(bend2)]
VT12  IRF3205  [TO-220(bend2)]
VT13  IRF3205  [TO-220(bend2)]
VT14  IRF3205  [TO-220(bend2)]
VT15  IRF3205  [TO-220(bend2)]
VT16  IRF3205  [TO-220(bend2)]
Z1  MM3Z5V1ST1G  [SOD2512X110N]
Z2  MM3Z5V1ST1G  [SOD2512X110N]

## Ports
+3.3V, +3.3V (bidir), CLEAR, Diff1, Diff2, Diff3, Diff4, DIRECT, DIRECT (bidir), INP_1, INP_2, INP_3, INP_4, INTERUPT, LED_1, LED_2, LED_3, PORT_1, PORT_2, PORT_3, PORT_4, PWM_1_1, PWM_1_2, PWM_2_1, PWM_2_2, PWM_3_1, PWM_3_2, PWM_4_1, PWM_4_2, RESET (bidir), RX, RX (bidir), RX_1, RX_1 (bidir), SCL (bidir), SDA (bidir), SENS_1, SENS_2, SENS_3, SENS_4, START, STOP, SWCLC (bidir), SWDIO (bidir), TIME_in_1, TX, TX (bidir), TX_1, TX_1 (bidir)

## Nets
+3V3: C1.2(A) C6.1(+) C8.1 C10.1 D27.2(A) D48.1(C) J6.1 J7.1 J11.1 P1.1 P12.1 R3.2 R4.2 R10.2 R116.2 R117.2 R118.2 U1.2(OUT) U1.4(TAB) U4.9(VDDA/VREF+) U4.24(VDD) U4.36(VDD) U4.48(VDD) ; port +3.3V
+5: C2.2(A) C24.1 C25.1 C26.1 C27.1 C28.1 D22.8(V+) D23.8(V+) J4.1 J6.2 J11.2 P2.3 P3.3 P4.3 P5.3 P6.3 P7.3 P8.3 P9.3 P10.3 P11.3 P13.5 R5.2 R56.2 R58.2 R72.2 R74.2 R87.2 R88.2 R99.2 R100.2 RG1.3(Output) RP2.1(CCW) RP3.1(CCW) RP4.1(CCW) RP5.1(CCW) RP6.1(CCW) RP7.1(CCW) RP8.1(CCW) RP9.1(CCW) TP3.1(G9) TP4.1(G9) TP13.1(G9) TP14.1(G9) U1.3(IN) U3.8(VCC)  [also labelled +5V]
GND: BT1.1(-) C1.1(C) C2.1(C) C3.1(C) C4.2(-) C5.2(-) C6.2(-) C8.2 C10.2 C17.1 C18.1 C19.1 C20.2 C21.2 C22.2 C23.2 C24.2 C25.2 C26.2 C27.2 C29.2 C30.2 C31.2 C32.2 C33.2 C34.2 C35.2 C36.2 CR2.2 D22.4(V-) D23.4(V-) D29.2(K) D30.2(K) D31.2(K) D47.2(K) D48.2(A) J1.1 J2.1 J4.2 J5.2 J6.6 J7.6 J11.6 J13.2 LED1.1(K) LED2.1(K) LED3.1(K) LED4.1(K) P1.4 P2.1 P3.1 P4.1 P5.1 P6.1 P7.1 P8.1 P9.1 P10.1 P11.1 P12.4 P13.1 R1.1 R2.2 R8.1 R9.1 R12.1 R13.1 R17.1 R18.1 R22.2 R23.1 R24.1 R29.1 R32.1 R35.1 R36.1 R37.1 R39.2 R40.1 R46.1 R47.1 R49.1 R50.1 R66.1 R67.1 R69.1 R70.1 R76.2 R77.2 R79.1 R80.1 R81.1 R82.1 R93.1 R94.1 R95.1 R96.1 R101.2 R102.2 R107.1 R109.1 R111.1 R112.1 RG1.2(GND) RP2.3(CW) RP3.3(CW) RP4.3(CW) RP5.3(CW) RP6.3(CW) RP7.3(CW) RP8.3(CW) RP9.3(CW) SW1.1 SW1.2 SW2.1 SW2.2 SW3.1 SW3.2 U1.1(GND) U2.3(GND) U2.5(~{ON}/OFF) U2.6(GND) U3.5(GND) U4.8(VSSA/VREF-) U4.23(VSS) U4.35(VSS) U4.47(VSS) U5.4(COM) U6.4(COM) U7.4(COM) U8.4(COM) U9.4(COM) U10.4(COM) U11.4(COM) U12.4(COM) Z1.2(A) Z2.2(A)
V_BAT: D28.1(C) D33.1(C) D35.1(C) D37.1(C) D39.1(C) D41.1(C) D43.1(C) D45.1(C) J12.2 J13.1 VT1.D VT2.D VT5.D VT7.D VT8.D VT9.D VT13.D VT14.D
VCC: C3.2(A) C5.1(+) C29.1 C30.1 C31.1 C32.1 C33.1 C34.1 C35.1 C36.1 D1.2(A) D2.2(A) D6.2(A) D10.2(A) D11.2(A) D12.2(A) D19.2(A) D20.2(A) J1.2 L1.2 RG1.1(Input) RP1.1(CCW) U5.1(VCC) U6.1(VCC) U7.1(VCC) U8.1(VCC) U9.1(VCC) U10.1(VCC) U11.1(VCC) U12.1(VCC)
CLEAR: C17.2 J11.5 R116.1 SW1.3 SW1.4 U4.41(PB5) ; port CLEAR
Diff1: D22.2(IN-) R54.1 R73.2 R74.1 R77.1 RP5.2(WIPER) TP12.1(G9) ; port Diff1
Diff2: D22.6(IN-) R53.1 R71.2 R72.1 R76.1 RP4.2(WIPER) TP11.1(G9) ; port Diff2
Diff3: D23.2(IN-) R84.1 R98.2 R100.1 R102.1 RP9.2(WIPER) TP22.1(G9) ; port Diff3
Diff4: D23.6(IN-) R83.1 R97.2 R99.1 R101.1 RP8.2(WIPER) TP21.1(G9) ; port Diff4
DIRECT: J6.5 R9.2 R119.2 U3.2(~{RE}) U3.3(DE) U4.31(PA10) ; port DIRECT
INP_1: R64.1 R70.2 TP8.1(G9) U4.14(PA4) ; port INP_1
INP_2: R62.1 R69.2 TP7.1(G9) U4.15(PA5) ; port INP_2
INP_3: R92.1 R96.2 TP18.1(G9) U4.16(PA6) ; port INP_3
INP_4: R91.1 R95.2 TP17.1(G9) U4.17(PA7) ; port INP_4
INTERUPT: R20.1 R22.1 U4.11(PA1) ; port INTERUPT
LED_1: P13.4 R113.2 U4.4(PC15-OSC_OUT) ; port LED_1
LED_2: P13.3 R114.2 U4.5(PF0-OSC_IN) ; port LED_2
LED_3: P13.2 R115.2 U4.6(PF1-OSC_OUT) ; port LED_3
PORT_1: R50.2 R82.2 U4.22(PB11) U10.3(*SD) U12.3(*SD) ; port PORT_1
PORT_2: R47.2 R80.2 U4.21(PB10) U9.3(*SD) U11.3(*SD) ; port PORT_2
PORT_3: R18.2 R40.2 U4.25(PB12) U5.3(*SD) U8.3(*SD) ; port PORT_3
PORT_4: R13.2 R24.2 U4.26(PB13) U6.3(*SD) U7.3(*SD) ; port PORT_4
PWM_1_1: R49.2 TP52.1(G9) U4.29(PA8) U10.2(IN) ; port PWM_1_1
PWM_1_2: R81.2 TP62.1(G9) U4.32(PA11) U12.2(IN) ; port PWM_1_2
PWM_2_1: R46.2 TP51.1(G9) U4.30(PA9) U9.2(IN) ; port PWM_2_1
PWM_2_2: R79.2 TP61.1(G9) U4.33(PA12) U11.2(IN) ; port PWM_2_2
PWM_3_1: R17.2 TP27.1(G9) U4.27(PB14) U5.2(IN) ; port PWM_3_1
PWM_3_2: R37.2 TP37.1(G9) U4.28(PB15) U8.2(IN) ; port PWM_3_2
PWM_4_1: R12.2 TP28.1(G9) U4.38(PA15) U6.2(IN) ; port PWM_4_1
PWM_4_2: R23.2 TP38.1(G9) U4.39(PB3) U7.2(IN) ; port PWM_4_2
RESET: R10.1 U4.7(NRST) ; port RESET
RX: J6.3 R4.1 U3.1(RO) U4.40(PB4) ; port RX
RX_1: J7.5 U4.43(PB7) ; port RX_1
SCL: P12.3 U4.45(PB8) ; port SCL
SDA: P12.2 U4.46(PB9) ; port SDA
SENS_1: C22.1 R110.1 R112.2 TP70.1(G9) U4.18(PB0) ; port SENS_1
SENS_2: C23.1 R108.1 R111.2 TP69.1(G9) U4.19(PB1) ; port SENS_2
SENS_3: C20.1 R30.1 R35.2 TP45.1(G9) U4.20(PB2) ; port SENS_3
SENS_4: C21.1 R33.1 R36.2 TP46.1(G9) U4.13(PA3) ; port SENS_4
START: C18.2 J11.3 R117.1 SW2.3 SW2.4 U4.2(PC13) ; port START
STOP: C19.2 J11.4 R118.1 SW3.3 SW3.4 U4.3(PC14-OSC32_IN) ; port STOP
SWCLC: J7.3 P1.3 U4.37(PA14) ; port SWCLC
SWDIO: J7.2 P1.2 U4.34(PA13) ; port SWDIO
TIME_in_1: R38.1 R39.1 U4.10(PA0) ; port TIME_in_1
TX: J6.4 R3.1 U3.4(DI) U4.12(PA2) ; port TX
TX_1: J7.4 U4.42(PB6) ; port TX_1
NetBT1_2: BT1.2(+) D27.1(C) U4.1(VBAT)
NetC4_1: C4.1(+) CR1.1 U2.1(Vin)
NetC7_1: C7.1 D2.1(C) TP24.1(G9) U6.8(VB)
NetC7_2: C7.2 D39.2(A) D40.1(C) J3.1 U6.6(VS) VT2.S VT3.D
NetC9_1: C9.1 D1.1(C) TP23.1(G9) U5.8(VB)
NetC9_2: C9.2 D28.2(A) D32.1(C) J8.1 U5.6(VS) VT1.S VT4.D
NetC11_1: C11.1 D6.1(C) TP34.1(G9) U7.8(VB)
NetC11_2: C11.2 D41.2(A) D42.1(C) J3.2 TP40.1(G9) U7.6(VS) VT5.S VT6.D
NetC12_1: C12.1 D10.1(C) TP33.1(G9) U8.8(VB)
NetC12_2: C12.2 D33.2(A) D34.1(C) J8.2 TP39.1(G9) U8.6(VS) VT7.S VT10.D
NetC13_1: C13.1 D11.1(C) TP47.1(G9) U9.8(VB)
NetC13_2: C13.2 D35.2(A) D36.1(C) J9.1 U9.6(VS) VT8.S VT11.D
NetC14_1: C14.1 D12.1(C) TP48.1(G9) U10.8(VB)
NetC14_2: C14.2 D43.2(A) D44.1(C) J10.1 U10.6(VS) VT9.S VT12.D
NetC15_1: C15.1 D19.1(C) TP57.1(G9) U11.8(VB)
NetC15_2: C15.2 D37.2(A) D38.1(C) J9.2 TP63.1(G9) U11.6(VS) VT13.S VT15.D
NetC16_1: C16.1 D20.1(C) TP58.1(G9) U12.8(VB)
NetC16_2: C16.2 D45.2(A) D46.1(C) J10.2 TP64.1(G9) U12.6(VS) VT14.S VT16.D
NetC28_2: C28.2 J5.1 R8.2 U3.6(A) Z1.1(K)
NetCR1_2: CR1.2 J2.2 J12.1
NetCR2_1: CR2.1 L1.1 TP1.1(G9) U2.2(Output)
NetD3_1: D3.1(C) R6.1 R7.2 TP26.1(G9)
NetD3_2: D3.2(A) R6.2 VT2.G
NetD4_1: D4.1(C) R11.1 R14.2 TP25.1(G9)
NetD4_2: D4.2(A) R11.2 VT1.G
NetD5_1: D5.1(C) R15.1 R16.2 TP30.1(G9)
NetD5_2: D5.2(A) R16.1 VT3.G
NetD7_1: D7.1(C) R25.1 R28.2 TP29.1(G9)
NetD7_2: D7.2(A) R28.1 VT4.G
NetD8_1: D8.1(C) R19.1 R21.2 TP36.1(G9)
NetD8_2: D8.2(A) R19.2 VT5.G
NetD9_1: D9.1(C) R26.1 R27.2
NetD9_2: D9.2(A) R27.1 VT6.G
NetD13_1: D13.1(C) R31.1 R34.2 TP35.1(G9)
NetD13_2: D13.2(A) R31.2 VT7.G
NetD14_1: D14.1(C) R41.1 R43.2 TP49.1(G9)
NetD14_2: D14.2(A) R41.2 VT8.G
NetD15_1: D15.1(C) R42.1 R44.2 TP50.1(G9)
NetD15_2: D15.2(A) R42.2 VT9.G
NetD16_1: D16.1(C) R45.1 R48.2
NetD16_2: D16.2(A) R48.1 VT10.G
NetD17_1: D17.1(C) R51.1 R59.2 TP53.1(G9)
NetD17_2: D17.2(A) R59.1 VT11.G
NetD18_1: D18.1(C) R52.1 R60.2 TP54.1(G9)
NetD18_2: D18.2(A) R60.1 VT12.G
NetD21_1: D21.1(C) R65.1 R75.2 TP59.1(G9)
NetD21_2: D21.2(A) R65.2 VT13.G
NetD22_1: D22.1(OUT) R54.2 R63.2 R64.2 TP6.1(G9)
NetD22_3: D22.3(IN+) R57.2 R58.1 R67.2 RP3.2(WIPER) TP10.1(G9)
NetD22_5: D22.5(IN+) R55.2 R56.1 R66.2 RP2.2(WIPER) TP9.1(G9)
NetD22_7: D22.7(OUT) R53.2 R61.2 R62.2 TP5.1(G9)
NetD23_1: D23.1(OUT) R84.2 R90.2 R92.2 TP16.1(G9)
NetD23_3: D23.3(IN+) R86.2 R88.1 R94.2 RP7.2(WIPER) TP20.1(G9)
NetD23_5: D23.5(IN+) R85.2 R87.1 R93.2 RP6.2(WIPER) TP19.1(G9)
NetD23_7: D23.7(OUT) R83.2 R89.2 R91.2 TP15.1(G9)
NetD24_1: D24.1(C) R68.1 R78.2 TP60.1(G9)
NetD24_2: D24.2(A) R68.2 VT14.G
NetD25_1: D25.1(C) R103.1 R105.2
NetD25_2: D25.2(A) R105.1 VT15.G
NetD26_1: D26.1(C) R104.1 R106.2
NetD26_2: D26.2(A) R106.1 VT16.G
NetD29_1: D29.1(A) R113.1
NetD30_1: D30.1(A) R114.1
NetD31_1: D31.1(A) R115.1
NetD32_2: D32.2(A) D34.2(A) R29.2 R30.2 TP43.1(G9) VT4.S VT10.S
NetD36_2: D36.2(A) D38.2(A) R107.2 R108.2 TP67.1(G9) VT11.S VT15.S
NetD40_2: D40.2(A) D42.2(A) R32.2 R33.2 TP44.1(G9) VT3.S VT6.S
NetD44_2: D44.2(A) D46.2(A) R109.2 R110.2 TP68.1(G9) VT12.S VT16.S
NetD47_1: D47.1(A) R119.1
NetJ5_3: J5.3 R5.1 U3.7(B) Z2.1(K)
NetLED1_2: LED1.2(A) R61.1
NetLED2_2: LED2.2(A) R63.1
NetLED3_2: LED3.2(A) R89.1
NetLED4_2: LED4.2(A) R90.1
NetP2_2: P2.2 R20.2
NetP3_2: P3.2 R55.1
NetP4_2: P4.2 R38.2
NetP5_2: P5.2 R57.1
NetP6_2: P6.2 R71.1
NetP7_2: P7.2 R73.1
NetP8_2: P8.2 R85.1
NetP9_2: P9.2 R86.1
NetP10_2: P10.2 R97.1
NetP11_2: P11.2 R98.1
NetR1_2: R1.2 RP1.3(CW)
NetR2_1: R2.1 U4.44(BOOT0)
NetR7_1: R7.1 U6.7(HO)
NetR14_1: R14.1 U5.7(HO)
NetR15_2: R15.2 TP32.1(G9) U6.5(LO)
NetR21_1: R21.1 U7.7(HO)
NetR25_2: R25.2 TP31.1(G9) U5.5(LO)
NetR26_2: R26.2 TP42.1(G9) U7.5(LO)
NetR34_1: R34.1 U8.7(HO)
NetR43_1: R43.1 U9.7(HO)
NetR44_1: R44.1 U10.7(HO)
NetR45_2: R45.2 TP41.1(G9) U8.5(LO)
NetR51_2: R51.2 TP55.1(G9) U9.5(LO)
NetR52_2: R52.2 TP56.1(G9) U10.5(LO)
NetR75_1: R75.1 U11.7(HO)
NetR78_1: R78.1 U12.7(HO)
NetR103_2: R103.2 TP65.1(G9) U11.5(LO)
NetR104_2: R104.2 TP66.1(G9) U12.5(LO)
NetRP1_2: RP1.2(WIPER) TP2.1(G9) U2.4(Feedback)

## Notes on the sheet
- (in symbol CMP-04424-000193-1) +
- (in symbol CMP-05427-000015-1) +

## Library data of the parts
C1 = CMP-04424-000193-1: 47uF 16V  ±20% 500mΩ 2312  SMD Tantalum Capacitor; Polarity: Polar; ESR (Equivalent Series Resistance): 500mR; Dissipation Factor: 6%; Leakage Current: 7.5uA; RoHS Compliant: Yes; Case/Package: 6032-28; Construction: Flat; Case Code (Imperial): 2312; Package Quantity: 1; Voltage Rating: 16V; Length: 6mm; Height - Seated (Max): 0.11inch; Voltage Rating (DC): 16V; Series: TAJ; Features: General Purpose; Radiation Hardening: No; Case Code (Metric): 6032; Tolerance: 20%; Max Operating Temperature: 125°C; Depth: 3.2mm; REACH SVHC: No SVHC; Capacitance: 47uF; Width: 3.2mm; Height: 2.8mm; Lead Free: Lead Free; Packaging: Tape and Reel; Number of Pins: 2; Min Operating Temperature: -55°C; Mount: Surface Mount; Termination: SMD/SMT
C2 C3 = CMP-05427-000015-1: CAP ALUM 100UF 20% 50V SMD; Manufacturer: Panasonic; Automotive Grade: Grade 3; Leakage Current: 100uA; Dissipation Factor: 0.12%; Life: 2000Hours; Ripple Current: 200mA; Material: Aluminum; ComponentLink2Description: Datasheet; Category: Cap; Voltage Rating: 50V; Value: 100uF; Octopart: https://octopart.com/eee-1ha101up-panasonic-55396734; Digikey Description: CAP ALUM 100UF 20% 50V SMD; Package: SF; RoHS: TRUE; Height: 10.5mm; ComponentLink2URL: https://industrial.panasonic.com/cdbs/www-data/pdf/RDE0000/ABA0000C1145.pdf; Tolerance: 20%; Mouser Description: Cap Aluminum Lytic 100uF 50V 20% (8 X 10.2mm) SMD 200mA 2000h 85C Automotive T/R; Device Class L2: Capacitors; Temperature Range High: +85°C; Lead Free: Yes; Device Class L3: Aluminum Electrolytic Capacitors; Device Class L1: Passive Components; Manufacturer Part Number: EEE-1HA101UP; Temperature: -40°C to +85°C; Automotive: Yes; Capacitance: 100uF; Voltage: 50V; Temperature Range Low: -40°C
C4 C5 = EEE1HA101AP: Capacitor Polarised; Manufacturer_Name: Panasonic; Datasheet Link: http://industrial.panasonic.com/cdbs/www-data/pdf/RDE0000/ABA0000C1142.pdf; Manufacturer_Part_Number: EEE1HA101AP
C6 = 293D106X9050E2TE3: Capacitor Polarised; Manufacturer_Name: Vishay; Datasheet Link: http://www.vishay.com/doc?40002; Height: 4.3mm; Manufacturer_Part_Number: 293D106X9050E2TE3; Mouser Part Number: 74-293D106X9050E2TE3; Mouser Price/Stock: https://www.mouser.com/Search/Refine.aspx?Keyword=74-293D106X9050E2TE3; Arrow Part Number: 293D106X9050E2TE3; Arrow Price/Stock: https://www.arrow.com/en/products/293d106x9050e2te3/vishay
C7 C9 C11-C16 = CMP-2007-03453-2: Chip Multilayer Ceramic Capacitors for General Purpose, 0805, 10uF, X5R, 15%, 10%, 16V; Radiation Hardening: No; Thickness: 0.053inch; Voltage Rating (DC): 16V; Lead Free: Lead Free; Package Quantity: 1; Width: 1.25mm; Case Code (Imperial): 0805; Depth: 1.25mm; Packaging: Tape and Reel; Dielectric: X5R; Max Operating Temperature: 85°C; Tolerance: 10%; Voltage Rating: 16V; Voltage: 16V; Capacitance: 10uF; Height: 1.25mm; Case Code (Metric): 2012; Material: Ceramic; Mount: Surface Mount; Case/Package: 0805; REACH SVHC: No SVHC; Length: 2mm; Min Operating Temperature: -55°C; Termination: SMD/SMT
C8 C10 C17-C36 = CMP-1036-04552-2: CAP CER 0.22UF 50V X7R 0805; Manufacturer: KEMET; Value: 0.22 μF; Temperature Coefficient: 30ppm/°C; Material: Ceramic; Tolerance: 0.1; ComponentLink2URL: https://content.kemet.com/datasheets/KEM_C1003_C0G_SMD.pdf; Temperature Characteristic: X7R; Device Class L3: Ceramic Capacitors; Lead Free: Yes; Temperature: -55°C to +125°C; RoHS: TRUE; Capacitance: 0.22 μF; Automotive: No; Octopart: https://octopart.com/c0805c224k5ractu-kemet-144670; Manufacturer Part Number: C0805C224K5RACTU; Temperature Range Low: -55°C; Height: 0.88mm; Device Class L1: Passive Components; Digikey Description: CAP CER 0.22UF 50V X7R 0805; ComponentLink2Description: Datasheet; Mouser Description: CAP CER 0.22UF 50V X7R 0805; Category: Cap; Ipc Land Pattern Name: CAPC200125X78; Temperature Range High: +125°C; Package: C0805C-DN; Device Class L2: Capacitors; Voltage Rating: 50 V
CR1 CR2 = 1N5822RL: No Description Available; Mfr_Name: STMicroelectronics; Type: DEV; Copyright: Copyright (C) 2022 Ultra Librarian. All rights reserved.; Manufacturer_Part_Number: 1N5822RL; RefDes: RefDes
D1 D2 D6 D10-D12 D19 D20 = CMP-12791-000009-1: DIODE GEN PURP 400V 1A SMA; Manufacturer: Diodes Inc.; Max Surge Forward Current: 30A; Peak Reverse Current: 5uA; Standoff Height: 0.05mm; Value: 20pF; Max Junction Temp: +150°C; Digikey Description: DIODE GEN PURP 400V 1A SMA; ComponentLink2URL: https://www.diodes.com/assets/Datasheets/ds16008.pdf; Device Class L1: Discrete Semiconductors; Mouser Description: Rectifiers 400V 1A; Manufacturer Part Number: US1G-13-F; Package: SMA; Height: 2.4mm; Automotive: No; Temperature Range High: +150°C; RoHS: TRUE; Lead Free: Yes; Temperature: -65°C to +150°C; Category: Diode; Octopart: https://octopart.com/us1g-13-f-diodes+inc.-334651; Temperature Range Low: -65°C; Forward Current: 1A; Footprint Url: https://www.diodes.com/assets/Package-Files/SMA.pdf; ComponentLink2Description: Datasheet; Reverse Voltage: 400V; Capacitance: 20pF; Device Class L3: Rectifier Diodes; Max Repetitive Reverse Voltage: 400V; Device Class L2: Diodes
D3-D5 D7-D9 D13-D18 D21 D24-D27 = CMP-249167-000001-1: DIODE GEN PURP 75V 150MA SOD80; Manufacturer: Vishay Small Signal; Max Junction Temp: +175°C; Automotive Grade: Grade 0; Capacitance: 4pF; Peak Reverse Current: 5uA; Forward Current: 300mA; Max Repetitive Reverse Voltage: 100V; Max Surge Forward Current: 2A; Value: 4pF; ComponentLink2Description: Datasheet; Height: 1.6mm; ComponentLink2URL: http://www.vishay.com/docs/85557/ll4148.pdf; Category: Diode; Lead Free: Yes; Device Class L3: Rectifier Diodes; Reverse Voltage: 75V; Mouser Description: Diodes - General Purpose, Power, Switching 100 Volt 100mA; RoHS: TRUE; Temperature: to +175°C; Automotive: Yes; Octopart: https://octopart.com/ll4448-gs08-vishay+small+signal-40886; Digikey Description: DIODE GEN PURP 75V 150MA SOD80; Manufacturer Part Number: LL4448-GS08; Temperature Range High: +175°C; Device Class L1: Discrete Semiconductors; Device Class L2: Diodes; Package: 6.560-5005.01-4
D22 D23 = LMV358AIDR: Микросхема сдвоенный ОУ; ComponentDescription: =ComponentTypе+', '+Comment+', '+Package; ComponentTypе: Микросхема сдвоенный ОУ; Package: 8-SOIC
D28 D32-D46 = CMP-02540-000074-1: DIODE GEN PURP 1KV 1A DO214BA; Forward Voltage: 1.2V; Reverse Recovery Time-Max: 2s; Recovery Time: 3000ns; Peak Non-Repetitive Surge Current: 30A; Max Reverse Current: 5uA; Reverse Recovery Time: 2us; Element Configuration: Single; Length: 4.75mm; Height: 2.74mm; Case/Package: DO-214BA; Average Rectified Current: 1A; Packaging: Tape and Reel; Forward Current: 1A; Width: 2.9mm; Package Quantity: 1; Max Repetitive Reverse Voltage (Vrrm): 1kV; Mount: Surface Mount; Radiation Hardening: No; Max Forward Surge Current (Ifsm): 30A; Max Surge Current: 30A; Reverse Voltage: 1kV; Max Operating Temperature: 175°C; RoHS Compliant: Yes; Series: SUPERECTIFIER®; Number of Pins: 2; Min Operating Temperature: -65°C; Lead Free: Lead Free; Max Reverse Voltage (DC): 1kV
D29-D31 D47 = 151031YS06000: WURTH ELEKTRONIK - 151031YS06000 - LED, Yellow, Through Hole, T-1 (3mm), 30 mA, 2 V, 590 nm; Geometry.Height: 5.5mm; Manufacturer_Name: Wurth Elektronik; Manufacturer_Part_Number: 151031YS06000; Mouser Part Number: 710-151031YS06000; Mouser Price/Stock: https://www.mouser.co.uk/ProductDetail/Wurth-Elektronik/151031YS06000?qs=LlUlMxKIyB3xSYYW%252BcuBiQ%3D%3D; Arrow Part Number: *; Arrow Price/Stock: *; Mouser Testing Part Number: *; Mouser Testing Price/Stock: *; Datasheet Link: https://katalog.we-online.de/led/datasheet/151031YS06000.pdf
D48 = CMP-14400-000025-1: DIODE ZENER 5.1V 300MW SOD323
J1-J4 J8-J10 J13 = 691101710002: WR-TBL Series 101 Horizontal Entry Modular, THT, pitch 5mm, 2p; Manufacturer: Wurth Elektronik; Modularity: Yes; Rated Current: 16A; Working Voltage: 250V; ComponentLink1Description: Website Link; ComponentLink1URL: https://www.we-online.com/redexpert/article/691101710002?ad; ComponentLink2Description: Datasheet Link; ComponentLink2URL: https://www.we-online.com/redexpert/spec/691101710002?ad; Manufacturer Part Number: 691101710002; Category: Terminal Blocks; Match Code: WR-TBL; Mount: Through Hole; Operating Temperature Max: 105°C; Operating Temperature Min: -40°C; Packaging: Box; Application: Pressure Clamp; Number of Pins: 2; Number of Rows: 1; Orientation: Horizontal; Pitch: 5mm
J5 = 691101710003: WR-TBL Series 101 Horizontal Entry Modular, Through Hole, pitch 5mm, 3p; Manufacturer: Wurth Elektronik; Pin Number: 3; Rated Current: 16A; Working Voltage: 250V; PCB/Cable/Panel: PCB; Modularity: Yes; ComponentLink1Description: Manufacturer Link; ComponentLink1URL: https://www.we-online.com/redexpert/article/691101710003?ad; ComponentLink2Description: Datasheet; ComponentLink2URL: https://www.we-online.com/redexpert/spec/691101710003?ad; Category: Terminal Blocks; Match Code: WR-TBL; Manufacturer Part Number: 691101710003; Mount: Through Hole; Operating Temperature Max: 105°C; Operating Temperature Min: -40°C; Packaging: Box; Pitch: 5mm; Orientation: Horizontal; Application: Pressure Clamp
L1 = 744776122: WE-PD2 SMT Power Inductor, size 1054, 22µH, 2.04A, 0.1Ω; Manufacturer: Wurth Elektronik; Case/Size Code: 1054; DC Resistance: 0.051Ω; Saturation Current: 2.07A; Self Resonant Frequency: 16MHz; Manufacturer Part Number: 744776122; Category: Unshielded Power Inductors; Match Code: WE-PD2; ComponentLink1Description: Website Link; ComponentLink1URL: https://www.we-online.com/redexpert/article/744776122?ad; ComponentLink2Description: Datasheet Link; ComponentLink2URL: https://www.we-online.com/redexpert/spec/744776122?ad; Mount: Surface Mount; Operating Temperature Max: 125°C; Operating Temperature Min: -40°C; Packaging: Tape and Reel; Length: 10mm; Width: 9mm; Height: 5.4mm; DC Resistance Max: 0.1Ω; Inductance: 22µH; Rated Current: 2.04A
LED1-LED4 = 151033BS03000: THT LED round mono-color waterclear, WL-TMRW , Blue; Manufacturer: Wuerth Elektronik; ComponentLink1Description: Manufacturer URL; ComponentLink2Description: Datasheet; ComponentLink1URL: http://www.we-online.com; ComponentLink2URL: http://katalog.we-online.de/pbs/datasheet/7448042001.pdfhttp://katalog.we-online.de/pbs/datasheet/7448042001.pdfhttp://katalog.we-online.de/pbs/datasheet/7448042001.pdfhttp://katalog.we-online.de/pbs/datasheet/151033BS03000.pdf; PartNumber: 151033BS03000; Emitting color: Blue; PackageReference: Type 3mm
P1 P12 = CMP-1024-00357-1: 0.025" SQ Post Header, Through-hole, Vertical, -55 to 125 degC, 2.54 mm Pitch, 4-Pin, Male, RoHS; Manufacturer: Samtec; Pitch: 2.54 mm; RoHS: True; ComponentLink3URL: http://www.samtec.com/documents/webfiles/cpdf/TSW-XXX-XX-XXX-X-XX-XXX-MKT.pdf; Mounting Technology: Through-hole; ComponentLink2URL: http://www.samtec.com/documents/webfiles/pdf/TSW_TH.PDF; ComponentLink1URL: http://www.samtec.com; ComponentLink3Description: Package Specification; PackageVersion: DM, 8/1988; ComponentLink2Description: Datasheet; PackageReference: TSW-104-08-X-S; PackageDescription: .025[0.64] SQ. Post Terminal Strip Assembly; PartNumber: TSW-104-08-G-S; ComponentLink1Description: Manufacturer URL; Temperature Range: -55 to 125 degC; DatasheetVersion: F-214; Orientation: Vertical
P2-P11 = 61900311121: WR-WTB THT Male Vertical Locking Header, pitch 2.54mm, 3p; Pin Number: 3; Contact Resistance: 20mOhm; Rated Current: 3A; Withstanding Voltage: 1000VAC; Working Voltage: 250VAC; ComponentLink1Description: Manufacturer; ComponentLink1URL: http://www.we-online.de; ComponentLink2Description: Datasheet; ComponentLink2URL: https://www.we-online.com/catalog/datasheet/61900311121.pdf; Pitch: 2.54mm; Published Date: January 2020; Publisher: Wurth Elektronik; Mounting Technology: THT; Packaging: Bag; Operating Temperature: -40 to +105degC; Part Number: 61900311121; Gender: Male; Type: Vertical
P13 = 61300511121: WR-PHD Pin Header, THT, Vertical, pitch 2.54mm, 1 Row, 5P; Manufacturer: Wurth Elektronik; Contact Resistance: 20mΩ; Rated Current: 3A; Working Voltage: 250V; Withstanding Voltage: 500V; ComponentLink1Description: Website Link; ComponentLink1URL: https://www.we-online.com/redexpert/article/61300511121?ad; ComponentLink2Description: Datasheet Link; ComponentLink2URL: https://www.we-online.com/redexpert/spec/61300511121?ad; Manufacturer Part Number: 61300511121; Category: Board-to-Board Connectors; Match Code: WR-PHD; Mount: Through Hole; Operating Temperature Max: 105°C; Operating Temperature Min: -40°C; Packaging: Bag; Gender: Pin Header; Number of Pins: 5; Number of Rows: 1; Orientation: Vertical; Pitch: 2.54mm
R1 R2 R10 R12 R15-R17 R23 R25-R28 R37 R45 R46 R48 R49 R51-R60 R66 R67 R71-R74 R76 R77 R79 R81 R83-R88 R93 R94 R97 R99-R106 = CRCW08050000Z0EA
  R12 R15-R17 R23 R25-R28 R37 R45 R46 R48 R49 R51-R54 R59 R60 R79 R81 R83 R84 R103-R106: 100k: *
  R55-R58 R66 R67 R71-R74 R76 R77 R85-R88 R93 R94 R97 R99-R102: 10k: *
R3-R5 R8 R9 R20 R22 R30 R33 R35 R36 R38 R39 R61-R64 R69 R70 R89-R92 R95 R96 R108 R110 R112-R115 R119 = RC0805FR-07100KL
R6 R7 R11 R14 R19 R21 R31 R34 R41-R44 R65 R68 R75 R78 = CMP-03412-028725-1: RES SMD 10 OHM 1% 1/8W 0805; Manufacturer: Yageo; Tolerance: 0.0001; Value: 10Ω; Temperature Coefficient: 50 ppm/°C; Voltage Rating: 150V; Power Rating: 0.125W; Package: RT0805; Lead Free: Yes; Manufacturer Part Number: RT0805FRE0710RL; Series: RT; Footprint Url: http://www.yageo.com/exep/pages/download/literatures/PYu-R_Mount_10.pdf; Temperature Range High: +155°C; Temperature Range Low: -55°C; Octopart: https://octopart.com/rt0805fre0710rl-yageo-39855890; Height: 0.6mm; Device Class L1: Passive Components; Mouser Description: High Precision-High Stability Chip Resistor Thin Film 0805 10Ohm 1% Paper T/R; ComponentLink2URL: http://www.yageo.com/documents/recent/PYu-RT_1-to-0.01_RoHS_L_9.pdf; Device Class L2: Resistors; Composition: Thin Film; Device Class L3: Chip SMD Resistors; Automotive: No; RoHS: TRUE; Ipc Land Pattern Name: RESC200125X50; Temperature: -55°C to +155°C; ComponentLink2Description: Datasheet; Resistance: 10Ω; Category: Res; Digikey Description: RES SMD 10 OHM 1% 1/8W 0805
R13 R18 R24 R40 R47 R50 R80 R82 R98 R116-R118 = CMP-2001-04908-2: RES Thick Film, 10kΩ, 1%, 0.125W, 100ppm/°C, 0805; Resistance: 10kR; Voltage Rating (DC): 150V; Power Rating: 125mW; Weight: 0.000194oz; Package Quantity: 5000; Military Standard: Not; Max Operating Temperature: 155°C; Temperature Coefficient: 100ppm/°C; Contact Plating: Tin; Width: 1.25mm; Height: 0.45mm; Radiation Hardening: No; Tolerance: 1%; Min Operating Temperature: -55°C; Voltage Rating: 150V; Length: 2mm; Depth: 1.25mm; Termination: SMD/SMT; Packaging: Tape and Reel; Case/Package: 0805; Case Code (Metric): 2012; Lead Free: Lead Free; Case Code (Imperial): 0805; Composition: Thick Film
R29 R32 R107 R109 = CMP-03413-000003-1: RES 1.2 OHM 5W 5% AXIAL; Manufacturer Part Number: SQP500JB-1R2; Manufacturer: Yageo; Temperature Coefficient: 300ppm/°C; Resistance: 1.2Ω; Value: 1.2Ω; Voltage Rating: 350V; Lead Free: Yes; Package: SQP500; Composition: Wirewound; Series: SQP; Temperature: -55°C to +155°C; Device Class L2: Resistors; Digikey Description: RES 1.2 OHM 5W 5% AXIAL; RoHS: TRUE; Device Class L3: Through-Hole Resistors; ComponentLink2Description: Datasheet; ComponentLink2URL: https://datasheet.ciiva.com/2723/yageolr-sqpnsp-2013-2723111.pdf; Temperature Range High: +155°C; Octopart: https://octopart.com/sqp500jb-1r2-yageo-1162571; Device Class L1: Passive Components; Tolerance: 5%; Height: 10mm; Category: Res; Ipc Land Pattern Name: RESAD2911W100L2350D1050; Automotive: No; Power Rating: 5W; Temperature Range Low: -55°C
R111 = RC0805FR-07100KL: 2.2K
RG1 = Reg_Fairchild_LM7805CT_eec: REG IC REG LINEAR 5V 1A TO220AB; Voltage Dropout (Max): 2V @ 1A (Typ); Voltage - Input (Max): 35V; helpURL: https://upverter.com/upn/revision/b27a7358b7dd93a3/; ComponentLink2Description: Datasheet; Temperature: -40°C to +125°C; Package: TO220; Supplier 2: Mouser; Price: 0.384521982769; Supplier 1: Digi-Key; ComponentLink1URL: https://upverter.com/upn/revision/b27a7358b7dd93a3/; Supplier Part Number 2: 512-LM7805CT; Supplier Part Number 1: LM7805CT-ND; Manufacturer: Fairchild; ComponentLink1Description: Upverter; ComponentLink2URL: https://www.fairchildsemi.com/datasheets/LM/LM7805.pdf; RoHS: TRUE; Mouser Part Number: 512-LM7805CT; Ipc Land Pattern Name: TO-220; Temperature Range High: +125°C; Digikey Description: REG IC REG LINEAR 5V 1A TO220AB; Digikey Part Number: LM7805CT-ND; Lead Free: yes; Temperature Range Low: -40°C; Voltage - Output: 5V; Current-Output: 1A
RP1-RP9 = 3296W-1-202LF
SW1-SW3 = 4-1437565-2: No Description Available; Mfr_Name: TE Connectivity; Copyright: Copyright (C) 2022 Ultra Librarian. All rights reserved.; Manufacturer_Part_Number: 4-1437565-2; RefDes: RefDes; Type: DEV
TP1-TP70 = TP_PCB?: Test_Point
U1 = CMP-0062-01639-4: 800mA Low-Dropout Linear Regulator, 4-pin SOT-223, Pb-Free; Manufacturer: Texas Instruments; High-Reliability: Y; PowerWise: N; PackageTopMarking: XYTT*N05A; CompType: LDO IC; ComponentLink1URL: http://www.ti.com/general/docs/lit/getliterature.tsp?genericPartNumber=LM1117-N&fileType=pdf; PartNumber: LM1117MPX-3.3/NOPB; ComponentLink1Description: Datasheet URL; PinCount: 4; Code_JEDEC: TO-261-AA; PackageDescription: Molded SOT-223, 6.50 x 3.56 x 1.6mm Body, 4 Lead, 2.3mm Pitch; PackageReference: DCY0004A; RoHS: Y; Code_IPC: SOT223-4
U2 = LM2576D2T-005G
U4 = STM32F303CCT6: No Description Available; Mfr_Name: STMicroelectronics; RefDes: RefDes; Type: Type
U5-U12 = IR2104SPBF: No Description Available; Mfr_Name: Infineon; Copyright: Copyright (C) 2023 Ultra Librarian. All rights reserved.; Manufacturer_Part_Number: IR2104SPBF; RefDes: RefDes; Type: DEV
VT1-VT16 = IRF3205: Транзистор МОП, одиночный, N-канальный; ComponentDescription: =ComponentType+', '+ChannelType+', '+Comment+', '+Package; ChannelType: N-канальный; ComponentType: Транзистор МОП, одиночный; Package: TO-220(bend2)
Z1 Z2 = MM3Z5V1ST1G: Zener Diode; Manufacturer_Name: onsemi; Datasheet Link: http://www.onsemi.com/pub/Collateral/MM3Z2V4ST1-D.PDF; Height: 1.1mm; Manufacturer_Part_Number: MM3Z5V1ST1G; Mouser Part Number: 863-MM3Z5V1ST1G; Mouser Price/Stock: https://www.mouser.co.uk/ProductDetail/onsemi/MM3Z5V1ST1G?qs=HVbQlW5zcXXFXX%2FQxsNWFg%3D%3D; Arrow Part Number: MM3Z5V1ST1G; Arrow Price/Stock: https://www.arrow.com/en/products/mm3z5v1st1g/on-semiconductor?region=nac